# EAGLE design PowerSection (EAGLE 9.5.0)

## Sheet 1 of 2
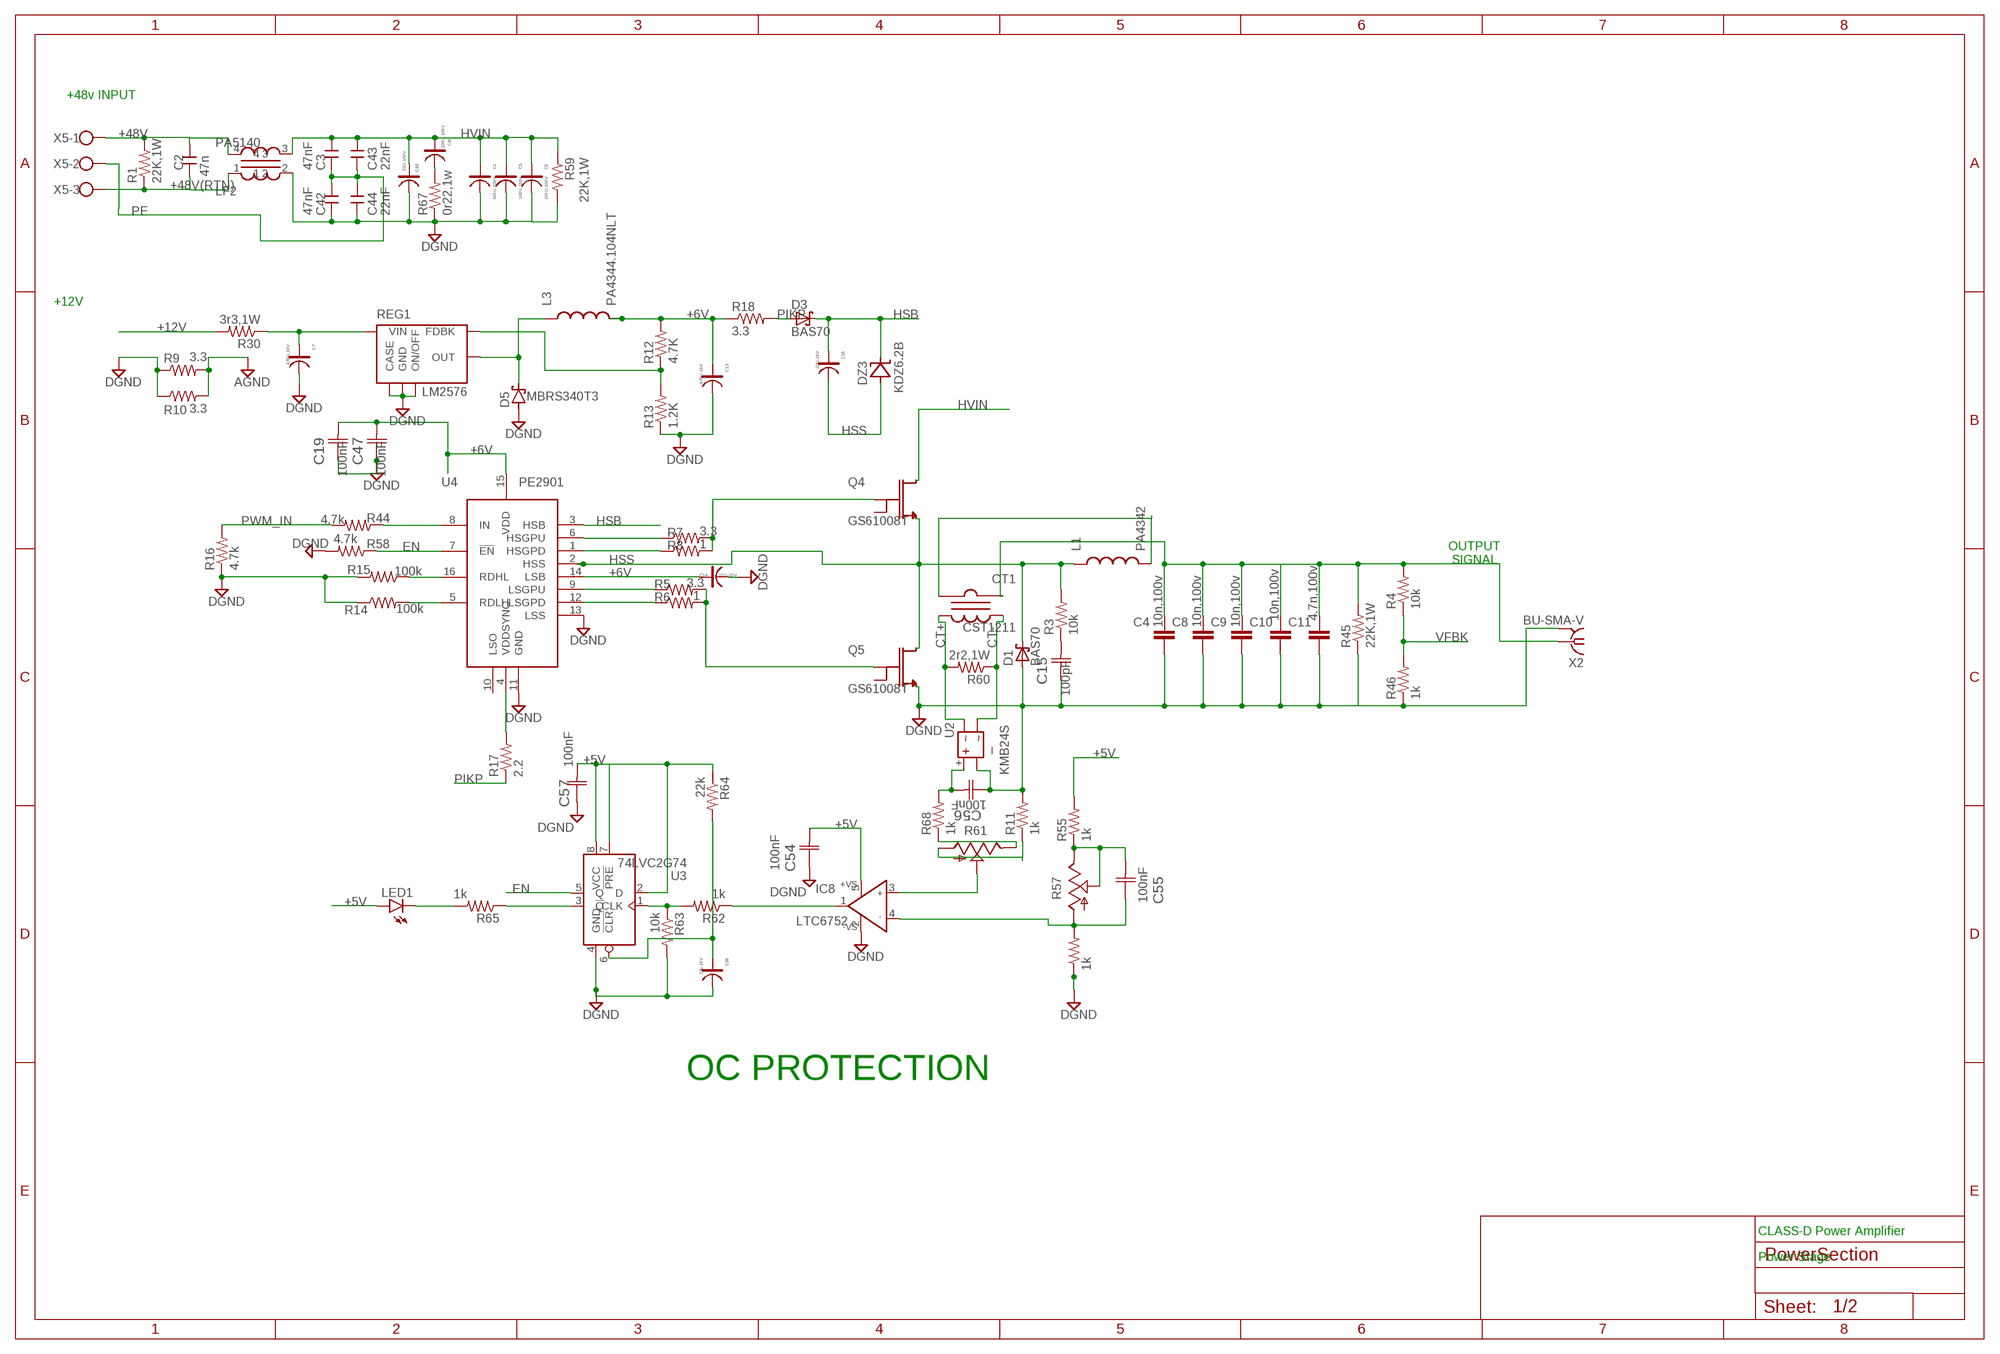
[diagram p0: schematic, sheet 1]

### Parts
C1  100U,100V  C-EDH-100V-100U  [CEL-EDH-9R]
C2  47n  C  [2220]
C3  47nF  C-SMD-2220  [2220]
C4  10n,100v  C-EUC2220K  [C2220K]
C5  100U,100v  C-EDH-100V-100U  [CEL-EDH-9R]
C6  100U,100V  C-EDH-100V-100U  [CEL-EDH-9R]
C7  470U,16V  C-EDH-470U,16V  [CEL-EDH-9P]
C8  10n,100v  C-EUC2220K  [C2220K]
C9  10n,100v  C-EUC2220K  [C2220K]
C10  10n,100v  C-EUC2220K  [C2220K]
C11  4.7n,100v  C-EUC2225K  [C2225K]
C13  470U,16V  C-EDH-470U,16V  [CEL-EDH-9P]
C14  10U-16V  C-EDK-10U-16V  [CEL-EDK-9B]
C15  100pF  C1206C104K1RACTU  [CAPC3216X88N]
C16  22U,16V  C-EDK-22U-16V  [CEL-EDK-9D]
C19  100nF  C1206C104K1RACTU  [CAPC3216X88N]
C42  47nF  C-SMD-2220  [2220]
C43  22nF  C-SMD-2220  [2220]
C44  22nF  C-SMD-2220  [2220]
C45  22U,100V  C-EDH-100V-22U  [CEL-EDH-9M]
C46  100U,100V  C-EDH-100V-100U  [CEL-EDH-9R]
C47  100nF  C1206C104K1RACTU  [CAPC3216X88N]
C54  100nF  C1206C104K5RACTU  [CAPC3216X88N]
C55  100nF  C1206C104K5RACTU  [CAPC3216X88N]
C56  100nF  C1206C104K5RACTU  [CAPC3216X88N]
C57  100nF  C1206C104K5RACTU  [CAPC3216X88N]
C58  22u,16V  C-EDK-22U-16V  [CEL-EDK-9D]
CT1  CST1211  [CST1211]
D1  BAS70  [SOT23]
D3  BAS70  [SOT23]
D5  MBRS340T3  [SMC]
DZ3  KDZ6.2B  KDZ36B  [SOD123FL]
IC8  LTC6752  AD8065RT  [SOT23-5]
L1  PA4342  [PA4342]
L3  PA4344.104NLT  [104NLT]
LED1  LEDCHIPLED_1206  [CHIPLED_1206]
LF2  PA5140  [PA5140.XXXNL]
Q4  GS61008T  [61008T]
Q5  GS61008T  [61008T]
R1  22K,1W  R-US_R2512W  [R2512W]
R3  10k  R-US_R1206  [R1206]
R4  10k  R-US_R1206  [R1206]
R5  3.3  R-US_R1206  [R1206]
R6  1  R-US_R1206  [R1206]
R7  3.3  R-US_R1206  [R1206]
R8  1  R-US_R1206  [R1206]
R9  3.3  R-US_R1206  [R1206]
R10  3.3  R-US_R1206  [R1206]
R11  1k  R-US_R1206  [R1206]
R12  4.7K  R-US_R1206  [R1206]
R13  1.2K  R-US_R1206  [R1206]
R14  100k  R-US_R1206  [R1206]
R15  100k  R-US_R1206  [R1206]
R16  4.7k  R-US_R1206  [R1206]
R17  2.2  R-US_R1206  [R1206]
R18  3.3  R-US_R1206  [R1206]
R30  3r3,1W  R-US_R2512W  [R2512W]
R44  4.7k  R-US_R1206  [R1206]
R45  22K,1W  R-US_R2512W  [R2512W]
R46  1k  R-US_R1206  [R1206]
R55  1k  R-US_R1206  [R1206]
R56  1k  R-US_R1206  [R1206]
R57  TRIM_US-3223G  [3223G]
R58  4.7k  R-US_R1206  [R1206]
R59  22K,1W  R-US_R2512W  [R2512W]
R60  2r2,1W  R-US_R2512W  [R2512W]
R61  TRIM_US-3223G  [3223G]
R62  1k  R-US_R1206  [R1206]
R63  10k  R-US_R1206  [R1206]
R64  22k  R-US_R1206  [R1206]
R65  1k  R-US_R1206  [R1206]
R67  0r22,1w  R-US_R2512W  [R2512W]
R68  1k  R-US_R1206  [R1206]
REG1  LM2576  [TO263-5]
U2  KMB24S  [SOIC-4]
U3  74LVC2G74  [SOT765]
U4  PE2901  [BGA20C40P5X4_164X204X28]
X2  BU-SMA-V  [BU-SMA-V]
X5  W237-103  [W237-103]

### Nets
+5V: C54.2(C2) C57.2(C2) IC8.5(+VS) LED1.A R55.2 R64.1 U3.2(D) U3.7(!PRE) U3.8(VCC) ; also sheet 2
+6V: C13.1 C14.1 C19.2(C2) C47.2(C2) L3.2 R12.2 R18.1 U4.14(LSB) U4.15(VDD)
+12V: R30.2 ; also sheet 2
+48V: C2.2 LF2.4 R1.2 X5.1 ; also sheet 2
+48V(RTN): C2.1 LF2.1 R1.1 X5.3 ; also sheet 2
AGND: R9.2 R10.2 ; also sheet 2
CT+: CT1.4(V_-) R60.2 U2.~2
CT-: CT1.5(V_+) R60.1 U2.~1
DGND: C1.2 C4.2 C5.2 C6.2 C7.2 C8.2 C9.2 C10.2 C11.2 C13.2 C14.2 C15.1(C1) C19.1(C1) C42.1 C44.1 C45.2 C47.1(C1) C54.1(C1) C56.1(C1) C57.1(C1) C58.2 D1.1(A) D5.A IC8.2(-VS) LF2.2 Q5.3 R9.1 R10.1 R11.2 R13.1 R14.1 R15.2 R16.1 R45.1 R46.1 R56.1 R58.2 R59.2 R63.2 R67.1 REG1.3(GND) REG1.5(ON/OFF) REG1.6(CASE) U2.- U3.4(GND) U4.11(GND) U4.13(LSS) X2.2 X2.3 X2.4 X2.5 ; also sheet 2
EN: R58.1 U3.5(Q) U4.7(!EN!)
HSB: C16.1 D3.3(K) DZ3.C U4.3(HSB)
HSS: C16.2 D1.3(K) DZ3.A L1.P$1 Q4.3 Q5.1 R3.2 U4.2(HSS)
HVIN: C1.1 C3.2 C5.1 C6.1 C43.2 C45.1 C46.1 LF2.3 Q4.1 R59.1
N$2: R61.3(E) R68.1
N$3: C4.1 C8.1 C9.1 C10.1 C11.1 CT1.1(C_IN) R4.2 R45.2 X2.1
N$4: C15.2(C2) R3.1
N$5: C7.1 R30.1 REG1.1(VIN)
N$6: R12.1 R13.2 REG1.4(FDBK)
N$7: D5.C L3.1 REG1.2(OUT)
N$8: R44.1 U4.8(IN)
N$9: R11.1 R61.1(A)
N$10: R15.1 U4.16(RDHL)
N$11: R17.2 U4.4(VDDSYNC)
N$12: R7.1 U4.6(HSGPU)
N$13: R8.1 U4.1(HSGPD)
N$14: R5.1 U4.9(LSGPU)
N$15: R6.1 U4.12(LSGPD)
N$20: CT1.2(C_OUT) L1.P$2
N$21: Q5.2 R5.2 R6.2
N$56: C56.2(C2) R68.2 U2.+
N$58: C46.2 R67.2
N$59: R14.2 U4.5(RDLH)
N$61: Q4.2 R7.2 R8.2
N$68: C55.1(C1) IC8.4(IN-) R56.2 R57.1(A)
N$69: IC8.3(IN+) R61.2(S)
N$70: IC8.1(OUT) R62.1
N$71: C55.2(C2) R55.1 R57.2(S) R57.3(E)
N$72: R62.2 R63.1 U3.1(CLK)
N$74: LED1.C R65.2
N$75: C58.1 R64.2 U3.6(!CLR)
N$76: R65.1 U3.3(!Q)
PE: C3.1 C42.2 C43.1 C44.2 X5.2 ; also sheet 2
PIKP: D3.1(A) R17.1 R18.2
PWM_IN: R16.2 R44.2 ; also sheet 2
VFBK: R4.1 R46.2 ; also sheet 2
Unconnected: Q4.4 Q5.4 U4.10(LSO)

### Notes on the sheet
- +48v INPUT
- +12V
- OUTPUT
   SIGNAL
- OC PROTECTION
- CLASS-D Power Amplifier
- Power Stage

## Sheet 2 of 2
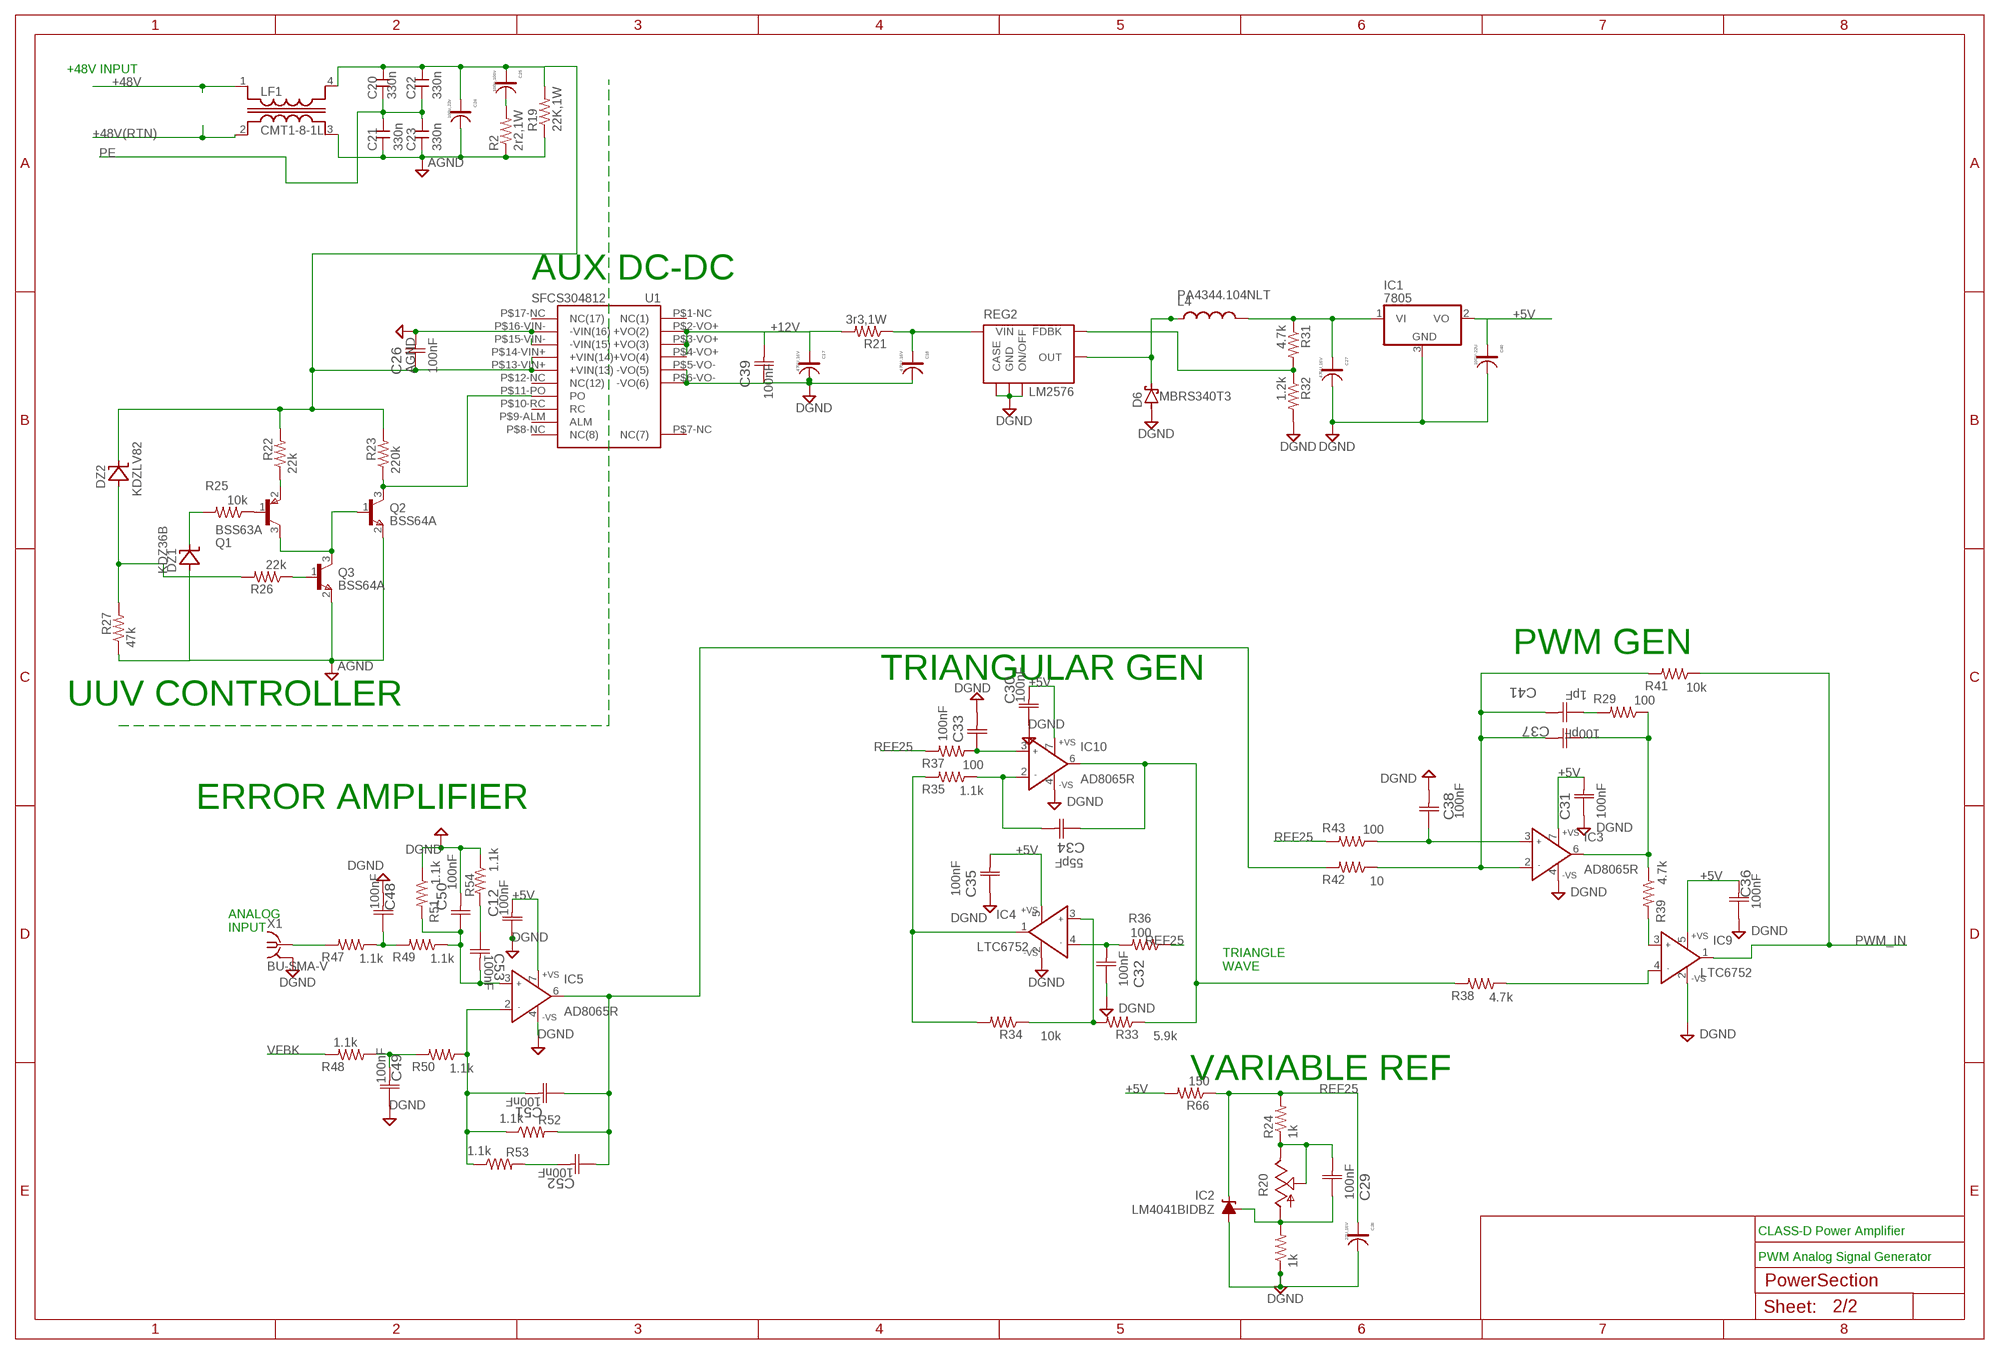
[diagram p1: schematic, sheet 2]

### Parts
C12  100nF  C1206C104K5RACTU  [CAPC3216X88N]
C17  470U,16V  C-EDH-470U,16V  [CEL-EDH-9P]
C18  470U,16V  C-EDH-470U,16V  [CEL-EDH-9P]
C20  330n  C  [2220]
C21  330n  C  [2220]
C22  330n  C  [2220]
C23  330n  C  [2220]
C24  100u,22v  C-EDH-100V-22U  [CEL-EDH-9M]
C25  100u,100v  C-EDH-100V-100U  [CEL-EDH-9R]
C26  100nF  C1206C104K1RACTU  [CAPC3216X88N]
C27  470U,16V  C-EDH-470U,16V  [CEL-EDH-9P]
C28  22U,16V  C-EDK-22U-16V  [CEL-EDK-9D]
C29  100nF  C1206C104K5RACTU  [CAPC3216X88N]
C30  100nF  C1206C104K5RACTU  [CAPC3216X88N]
C31  100nF  C1206C104K5RACTU  [CAPC3216X88N]
C32  100nF  C1206C104K5RACTU  [CAPC3216X88N]
C33  100nF  C1206C104K5RACTU  [CAPC3216X88N]
C34  55pF  C1206C104K5RACTU  [CAPC3216X88N]
C35  100nF  C1206C104K5RACTU  [CAPC3216X88N]
C36  100nF  C1206C104K5RACTU  [CAPC3216X88N]
C37  100pF  C1206C104K5RACTU  [CAPC3216X88N]
C38  100nF  C1206C104K5RACTU  [CAPC3216X88N]
C39  100nF  C1206C104K1RACTU  [CAPC3216X88N]
C40  100V-22U  C-EDH-100V-22U  [CEL-EDH-9M]
C41  1pF  C1206C104K5RACTU  [CAPC3216X88N]
C48  100nF  C1206C104K5RACTU  [CAPC3216X88N]
C49  100nF  C1206C104K5RACTU  [CAPC3216X88N]
C50  100nF  C1206C104K5RACTU  [CAPC3216X88N]
C51  100nF  C1206C104K5RACTU  [CAPC3216X88N]
C52  100nF  C1206C104K5RACTU  [CAPC3216X88N]
C53  100nF  C1206C104K5RACTU  [CAPC3216X88N]
D6  MBRS340T3  [SMC]
DZ1  KDZ36B  [SOD123FL]
DZ2  KDZLV82  [SOD123FL]
IC1  7805  7815DT  [TO252]
IC2  LM4041BIDBZ  [DBZ_R-PDSO-G3]
IC3  AD8065R  [SO8]
IC4  LTC6752  AD8065RT  [SOT23-5]
IC5  AD8065R  [SO8]
IC9  LTC6752  AD8065RT  [SOT23-5]
IC10  AD8065R  [SO8]
L4  PA4344.104NLT  [104NLT]
LF1  CMT1-8-1L  [CMT1-8-1L]
Q1  BSS63A  [SOT23]
Q2  BSS64A  [SOT23]
Q3  BSS64A  [SOT23]
R2  2r2,1W  R-US_R2512W  [R2512W]
R19  22K,1W  R-US_R2512W  [R2512W]
R20  TRIM_US-3223G  [3223G]
R21  3r3,1W  R-US_R2512W  [R2512W]
R22  22k  R-US_R1206  [R1206]
R23  220k  R-US_R1206  [R1206]
R24  1k  R-US_R1206  [R1206]
R25  10k  R-US_R1206  [R1206]
R26  22k  R-US_R1206  [R1206]
R27  47k  R-US_R1206  [R1206]
R28  1k  R-US_R1206  [R1206]
R29  100  R-US_R1206  [R1206]
R31  4.7k  R-US_R1206  [R1206]
R32  1.2k  R-US_R1206  [R1206]
R33  5.9k  R-US_R1206  [R1206]
R34  10k  R-US_R1206  [R1206]
R35  1.1k  R-US_R1206  [R1206]
R36  100  R-US_R1206  [R1206]
R37  100  R-US_R1206  [R1206]
R38  4.7k  R-US_R1206  [R1206]
R39  4.7k  R-US_R1206  [R1206]
R41  10k  R-US_R1206  [R1206]
R42  10  R-US_R1206  [R1206]
R43  100  R-US_R1206  [R1206]
R47  1.1k  R-US_R1206  [R1206]
R48  1.1k  R-US_R1206  [R1206]
R49  1.1k  R-US_R1206  [R1206]
R50  1.1k  R-US_R1206  [R1206]
R51  1.1k  R-US_R1206  [R1206]
R52  1.1k  R-US_R1206  [R1206]
R53  1.1k  R-US_R1206  [R1206]
R54  1.1k  R-US_R1206  [R1206]
R66  150  R-US_R1206  [R1206]
REG2  LM2576  [TO263-5]
U1  SFCS304812  [SFCS_SMD]
X1  BU-SMA-V  [BU-SMA-V]

### Nets
+5V: C12.2(C2) C30.2(C2) C31.2(C2) C35.2(C2) C36.2(C2) C40.1 IC1.2(VO) IC3.7(+VS) IC4.5(+VS) IC5.7(+VS) IC9.5(+VS) IC10.7(+VS) R66.2 ; also sheet 1
+12V: C17.1 C39.2(C2) R21.2 U1.P$2-VO+(+VO(2)) U1.P$3-VO+(+VO(3)) U1.P$4-VO+(+VO(4)) ; also sheet 1
+48V: LF1.1 ; also sheet 1
+48V(RTN): LF1.2 ; also sheet 1
AGND: C21.1 C23.1 C24.2 C26.2(C2) DZ1.A LF1.3 Q2.2(E) Q3.2(E) R2.1 R19.1 R27.1 U1.P$16-VIN-(-VIN(16)) ; also sheet 1
DGND: C12.1(C1) C17.2 C18.2 C27.2 C28.2 C30.1(C1) C31.1(C1) C32.1(C1) C33.2(C2) C35.1(C1) C36.1(C1) C38.2(C2) C39.1(C1) C40.2 C48.2(C2) C49.1(C1) C50.2(C2) D6.A IC1.3(GND) IC2.3(A) IC3.4(-VS) IC4.2(-VS) IC5.4(-VS) IC9.2(-VS) IC10.4(-VS) R28.1 R32.2 R51.1 R54.1 REG2.3(GND) REG2.5(ON/OFF) REG2.6(CASE) U1.P$5-VO-(-VO(5)) U1.P$6-VO-(-VO(6)) X1.2 X1.3 X1.4 X1.5 ; also sheet 1
N$1: C25.2 R2.2
N$16: R47.2 X1.1
N$17: C48.1(C1) R47.1 R49.2
N$18: C50.1(C1) C53.2(C2) IC5.3(IN+) R49.1 R51.2
N$22: C20.2 C22.2 C24.1 C25.1 C26.1(C1) DZ2.C LF1.4 R19.2 R22.2 R23.2 U1.P$13-VIN+(+VIN(13))
N$23: Q1.1(B) R25.1
N$24: C18.1 R21.1 REG2.1(VIN)
N$28: Q1.2(E) R22.1
N$29: Q2.3(C) R23.1 U1.P$11-PO(PO)
N$30: DZ1.C R25.2
N$31: DZ2.A R26.2 R27.2
N$32: U1.P$14-VIN+(+VIN(14))
N$34: Q3.1(B) R26.1
N$35: U1.P$15-VIN-(-VIN(15))
N$37: R31.2 R32.1 REG2.4(FDBK)
N$38: D6.C L4.1 REG2.2(OUT)
N$39: C32.2(C2) IC4.4(IN-) R36.2
N$40: C33.1(C1) IC10.3(IN+) R37.1
N$41: C34.2(C2) IC10.2(IN-) R35.1
N$42: C34.1(C1) IC10.6(OUT) R33.1 R38.2
N$43: IC9.4(IN-) R38.1
N$44: C51.1(C1) C52.1(C1) IC5.6(OUT) R42.2 R52.2
N$45: C37.2(C2) C41.2(C2) IC3.2(IN-) R41.2 R42.1
N$46: IC4.3(IN+) R33.2 R34.1
N$47: IC4.1(OUT) R34.2 R35.2
N$48: Q1.3(C) Q2.1(B) Q3.3(C)
N$49: C29.2(C2) R20.2(S) R20.3(E) R24.1
N$50: C38.1(C1) IC3.3(IN+) R43.1
N$51: IC9.3(IN+) R39.2
N$52: C37.1(C1) IC3.6(OUT) R29.1 R39.1
N$53: C27.1 IC1.1(VI) L4.2 R31.1
N$54: C29.1(C1) IC2.1(FB) R20.1(A) R28.2
N$55: C41.1(C1) R29.2
N$62: C51.2(C2) IC5.2(IN-) R50.1 R52.1 R53.1
N$64: C49.2(C2) R48.1 R50.2
N$65: C53.1(C1) R54.2
N$67: C52.2(C2) R53.2
PE: C20.1 C21.2 C22.1 C23.2 ; also sheet 1
PWM_IN: IC9.1(OUT) R41.1 ; also sheet 1
REF25: C28.1 IC2.2(C) R24.2 R36.1 R37.2 R43.2 R66.1
VFBK: R48.2 ; also sheet 1
Unconnected: U1.P$1-NC(NC(1)) U1.P$7-NC(NC(7)) U1.P$8-NC(NC(8)) U1.P$9-ALM(ALM) U1.P$10-RC(RC) U1.P$12-NC(NC(12)) U1.P$17-NC(NC(17))

### Notes on the sheet
- +48V INPUT
- AUX DC-DC
- PWM GEN
- TRIANGULAR GEN
- UUV CONTROLLER
- ERROR AMPLIFIER
- ANALOG
  INPUT
- TRIANGLE
  WAVE
- VARIABLE REF
- CLASS-D Power Amplifier
- PWM Analog Signal Generator

## Library data of the parts
C1 C5 C6 C25 C46 = thesislib:C-EDH-100V-100U
C2 C20-C23 = thesislib:C: CAPACITOR
C3 C42-C44 = thesislib:C-SMD-2220: CAPACITOR
C4 C8-C11 = rcl:C-EU: CAPACITOR, European symbol; SPICEPREFIX: C
C7 C13 C17 C18 C27 = thesislib:C-EDH-470U,16V
C12 C29-C33 C35 C36 C38 C48-C57 = Kemet_By_element14_Batch_1:C1206C104K5RACTU: CAPACITOR, 1206; MPN: C1206C104K5RACTU; OC_FARNELL: 1414715; OC_NEWARK: 70K9167; SUPPLIER: Kemet; TOLERANCE: ±10%; VOLTAGERATING: 50V
C14 = thesislib:C-EDK-10U-16V
C15 = Kemet_By_element14_Batch_1:C1206C104K1RACTU: CAPACITOR, 1206; MPN: C1206C104K1RACTU; OC_FARNELL: 1414714; OC_NEWARK: 85C2205; SUPPLIER: Kemet; TOLERANCE: ±10%; VALUE: 100nF; VOLTAGERATING: 100V
C16 C28 C58 = thesislib:C-EDK-22U-16V
C19 C26 C39 C47 = Kemet_By_element14_Batch_1:C1206C104K1RACTU: CAPACITOR, 1206; MPN: C1206C104K1RACTU; OC_FARNELL: 1414714; OC_NEWARK: 85C2205; SUPPLIER: Kemet; TOLERANCE: ±10%; VOLTAGERATING: 100V
C24 C40 C45 = thesislib:C-EDH-100V-22U
C34 C37 C41 = Kemet_By_element14_Batch_1:C1206C104K5RACTU: CAPACITOR, 1206; MPN: C1206C104K5RACTU; OC_FARNELL: 1414715; OC_NEWARK: 70K9167; SUPPLIER: Kemet; TOLERANCE: ±10%; VALUE: 100nF; VOLTAGERATING: 50V
CT1 = thesislib:CST1211
D1 D3 = nxp_60_1_1:BAS70: General-purpose Schottky diode General-purpose Schottky diodes in small Surface-Mounted Device (SMD) plastic packages. AAL Eindhoven MK
D5 D6 = diode:MBRS3*0T3: SCHOTTKY BARRIER RECTIFIER 3.0 AMPERES 20, 30, 40 VOLT Source: MBRS340T3-D.pdf
DZ1 DZ3 = thesislib:KDZ36B
DZ2 = thesislib:KDZLV82
IC1 = linear:78*: Positive VOLTAGE REGULATOR Source: http://cache.national.com/ds/LM/LM78L05.pdf http://www.fairchildsemi.com/ds/LM/LM7805.pdf
IC2 = texas:LM4041*I: PRECISION MICROPOWER SHUNT VOLTAGE REFERENCE Adjustable Output Source: http://focus.ti.com/lit/ds/slcs146e/slcs146e.pdf; OC_FARNELL: unknown; OC_NEWARK: unknown
IC3 IC5 IC10 = analog-devices:AD8065: High Performance, 145 MHz FastFET Op Amps Source: http://www.analog.com/static/imported-files/data_sheets/AD8065_8066.pdf; OC_FARNELL: unknown; OC_NEWARK: unknown
IC4 IC8 IC9 = analog-devices:AD8065: High Performance, 145 MHz FastFET Op Amps Source: http://www.analog.com/static/imported-files/data_sheets/AD8065_8066.pdf; MF: ALTERA CORPORATION; MPN: AD8065ARTZ-REEL7; OC_FARNELL: 1464845; OC_NEWARK: 59K6316
L1 = thesislib:PA4342
L3 L4 = thesislib:PA4344.104NLT
LED1 = led:LED: LED OSRAM: - CHIPLED LG R971, LG N971, LY N971, LG Q971, LY Q971, LO R971, LY R971 LH N974, LH R974 LS Q976, LO Q976, LY Q976 LO Q996 - Hyper CHIPLED LW Q18S LB Q993, LB Q99A, LB R99A - SideLED LS A670, LO A670, LY A670, LG A670, LP A670 LB A673, LV A673, LT A673, LW A673 LH A674 LY A675 LS A676, LA A676, LO A676, LY A676, LW A676 LS A679, LY A679, LG A679 - Hyper Micro SIDELED® LS Y876, LA Y876, LO Y876, LY Y876 LT Y87S - SmartLED LW L88C, LW L88S LB L89C, LB L89S, LG L890 LS L89K, LO L89K, LY L89K LS L896, LA L896, LO L896, LY L896 - TOPLED LS T670, LO T670, LY T670, LG T670, LP T670 LSG T670, LSP T670, LSY T670, LOP T670, LYG T670 LG T671, LOG T671, LSG T671 LB T673, LV T673, LT T673, LW T673 LH T674 LS T676, LA T676, LO T676, LY T676, LB T676, LH T676, LSB T676, LW T676 LB T67C, LV T67C, LT T67C, LS T67K, LO T67K, LY T67K, LW E67C LS E67B, LA E67B, LO E67B, LY E67B, LB E67C, LV E67C, LT E67C LW T67C LS T679, LY T679, LG T679 LS T770, LO T770, LY T770, LG T770, LP T770 LB T773, LV T773, LT T773, LW T773 LH T774 LS E675, LA E675, LY E675, LS T675 LS T776, LA T776, LO T776, LY T776, LB T776 LHGB T686 LT T68C, LB T68C - Hyper Mini TOPLED® LB M676 - Mini TOPLED Santana® LG M470 LS M47K, LO M47K, LY M47K Source: http://www.osram.convergy.de LUXEON: - LUMILED® LXK2-PW12-R00, LXK2-PW12-S00, LXK2-PW14-U00, LXK2-PW14-V00 LXK2-PM12-R00, LXK2-PM12-S00, LXK2-PM14-U00 LXK2-PE12-Q00, LXK2-PE12-R00, LXK2-PE12-S00, LXK2-PE14-T00, LXK2-PE14-U00 LXK2-PB12-K00, LXK2-PB12-L00, LXK2-PB12-M00, LXK2-PB14-N00, LXK2-PB14-P00, LXK2-PB14-Q00 LXK2-PR12-L00, LXK2-PR12-M00, LXK2-PR14-Q00, LXK2-PR14-R00 LXK2-PD12-Q00, LXK2-PD12-R00, LXK2-PD12-S00 LXK2-PH12-R00, LXK2-PH12-S00 LXK2-PL12-P00, LXK2-PL12-Q00, LXK2-PL12-R00 Source: www.luxeon.com KINGBRIGHT: KA-3528ASYC Source: www.kingbright.com
LF1 = thesislib:CMT1-8-1L
LF2 = thesislib:PA5140
Q1 = thesislib:BSS63A
Q2 Q3 = thesislib:BSS64A
Q4 Q5 = thesislib:GS61008T
R1-R19 R21-R39 R41-R56 R58-R60 R62-R68 = rcl:R-US_: RESISTOR, American symbol; SPICEPREFIX: R
R20 R57 R61 = pot:TRIM_US-: POTENTIOMETER
REG1 REG2 = thesislib:LM2576
U1 = thesislib:SFCS304812
U2 = thesislib:KMB24S
U3 = thesislib:74LVC2G74
U4 = thesislib:PE2901
X1 X2 = con-coax:BU-SMA-V: FEMALE SMA CONNECTOR Radiall distributor RS 112-3794; OC_FARNELL: unknown; OC_NEWARK: unknown
X5 = con-wago-500:W237-103: WAGO SCREW CLAMP; MPN: 237-103; OC_FARNELL: unknown; OC_NEWARK: 18M7116

## Board
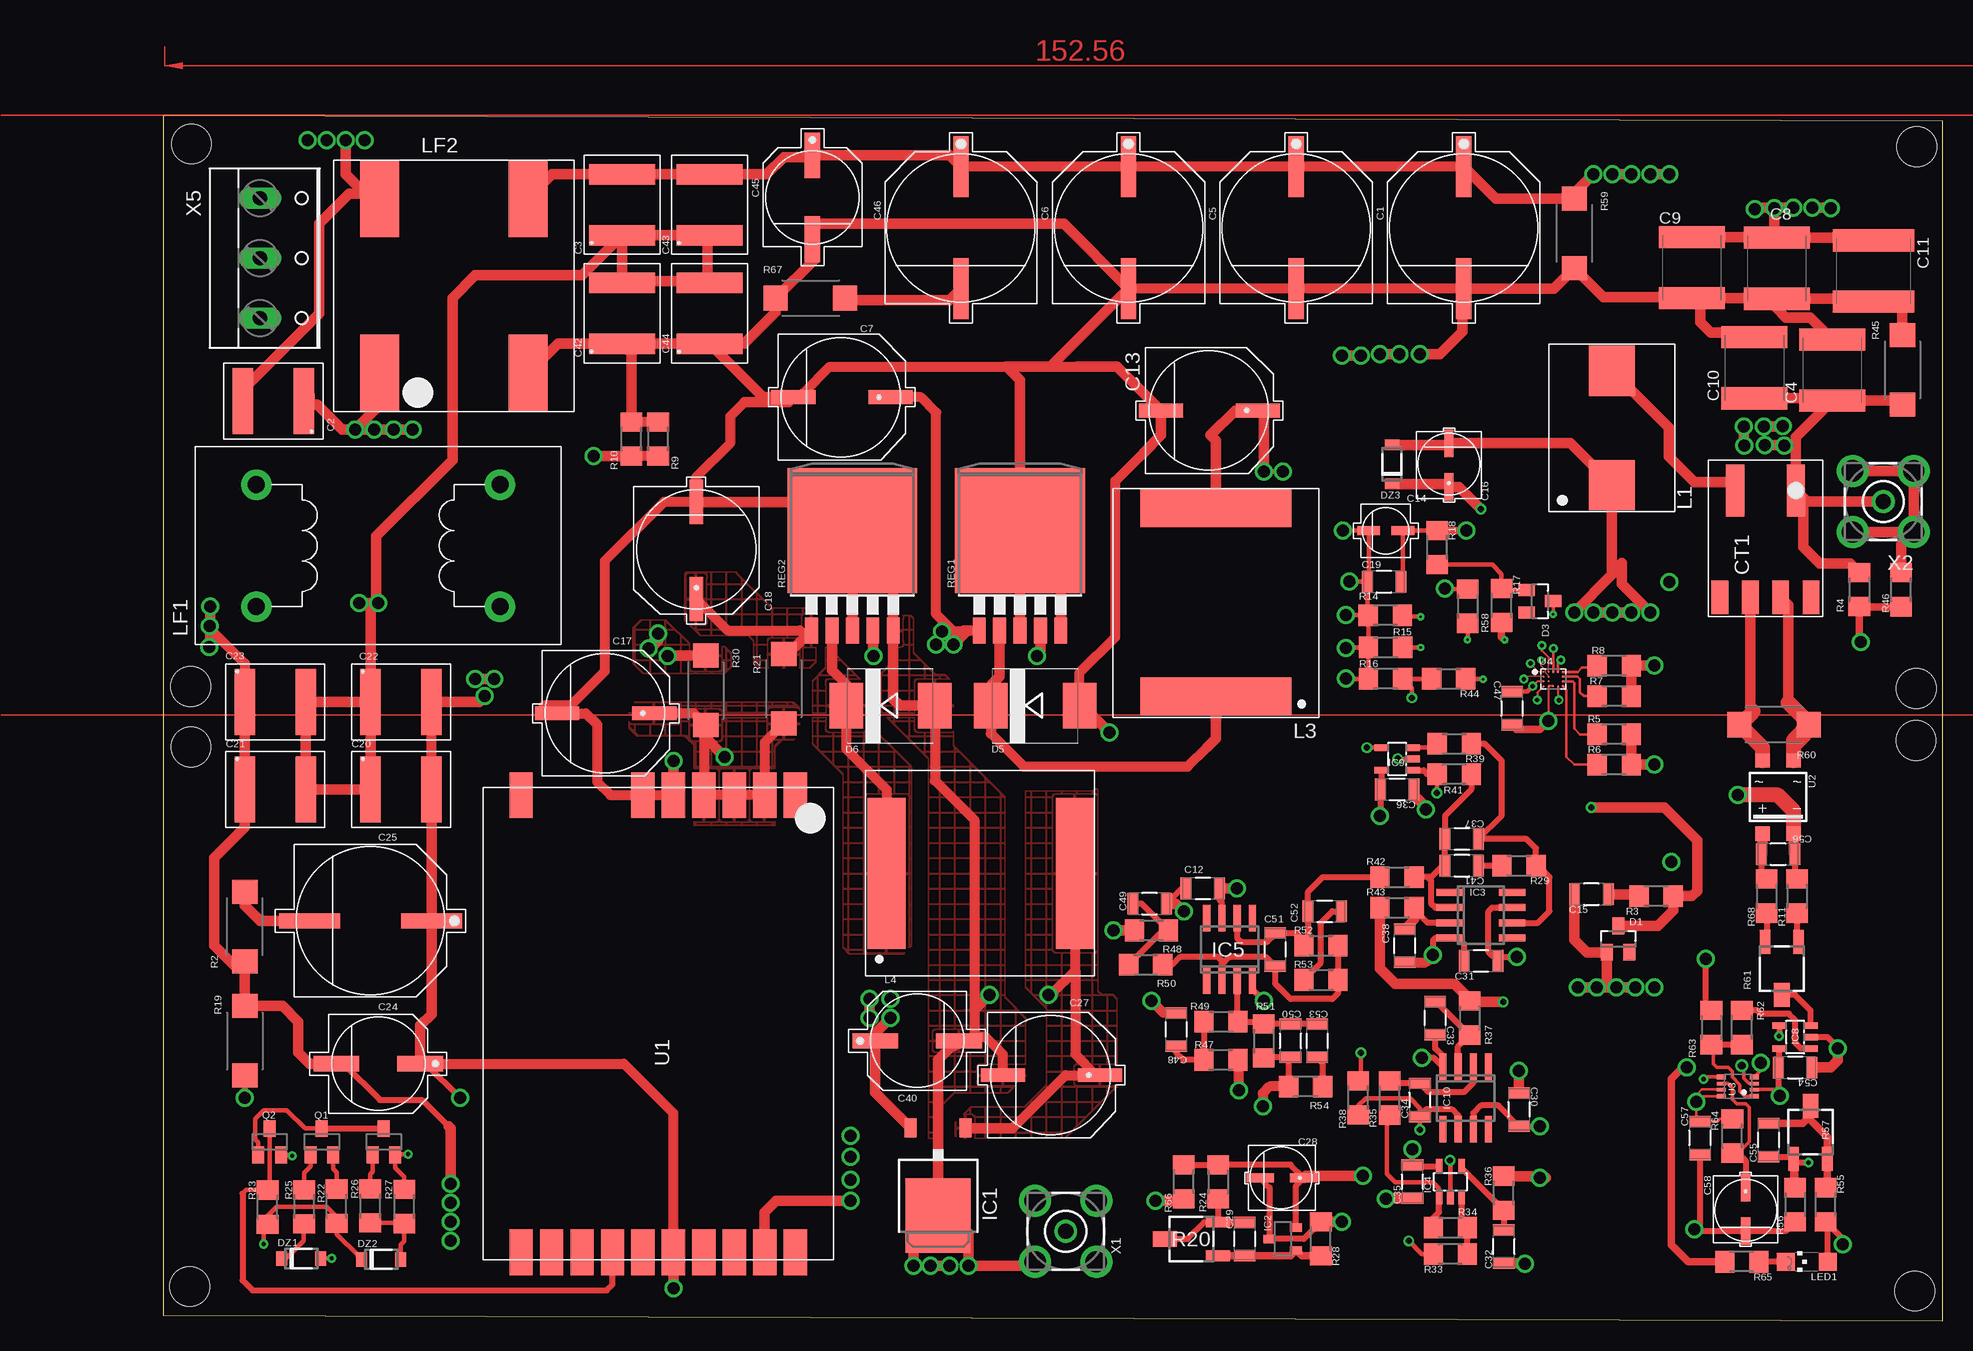
[diagram p2: board, top side]
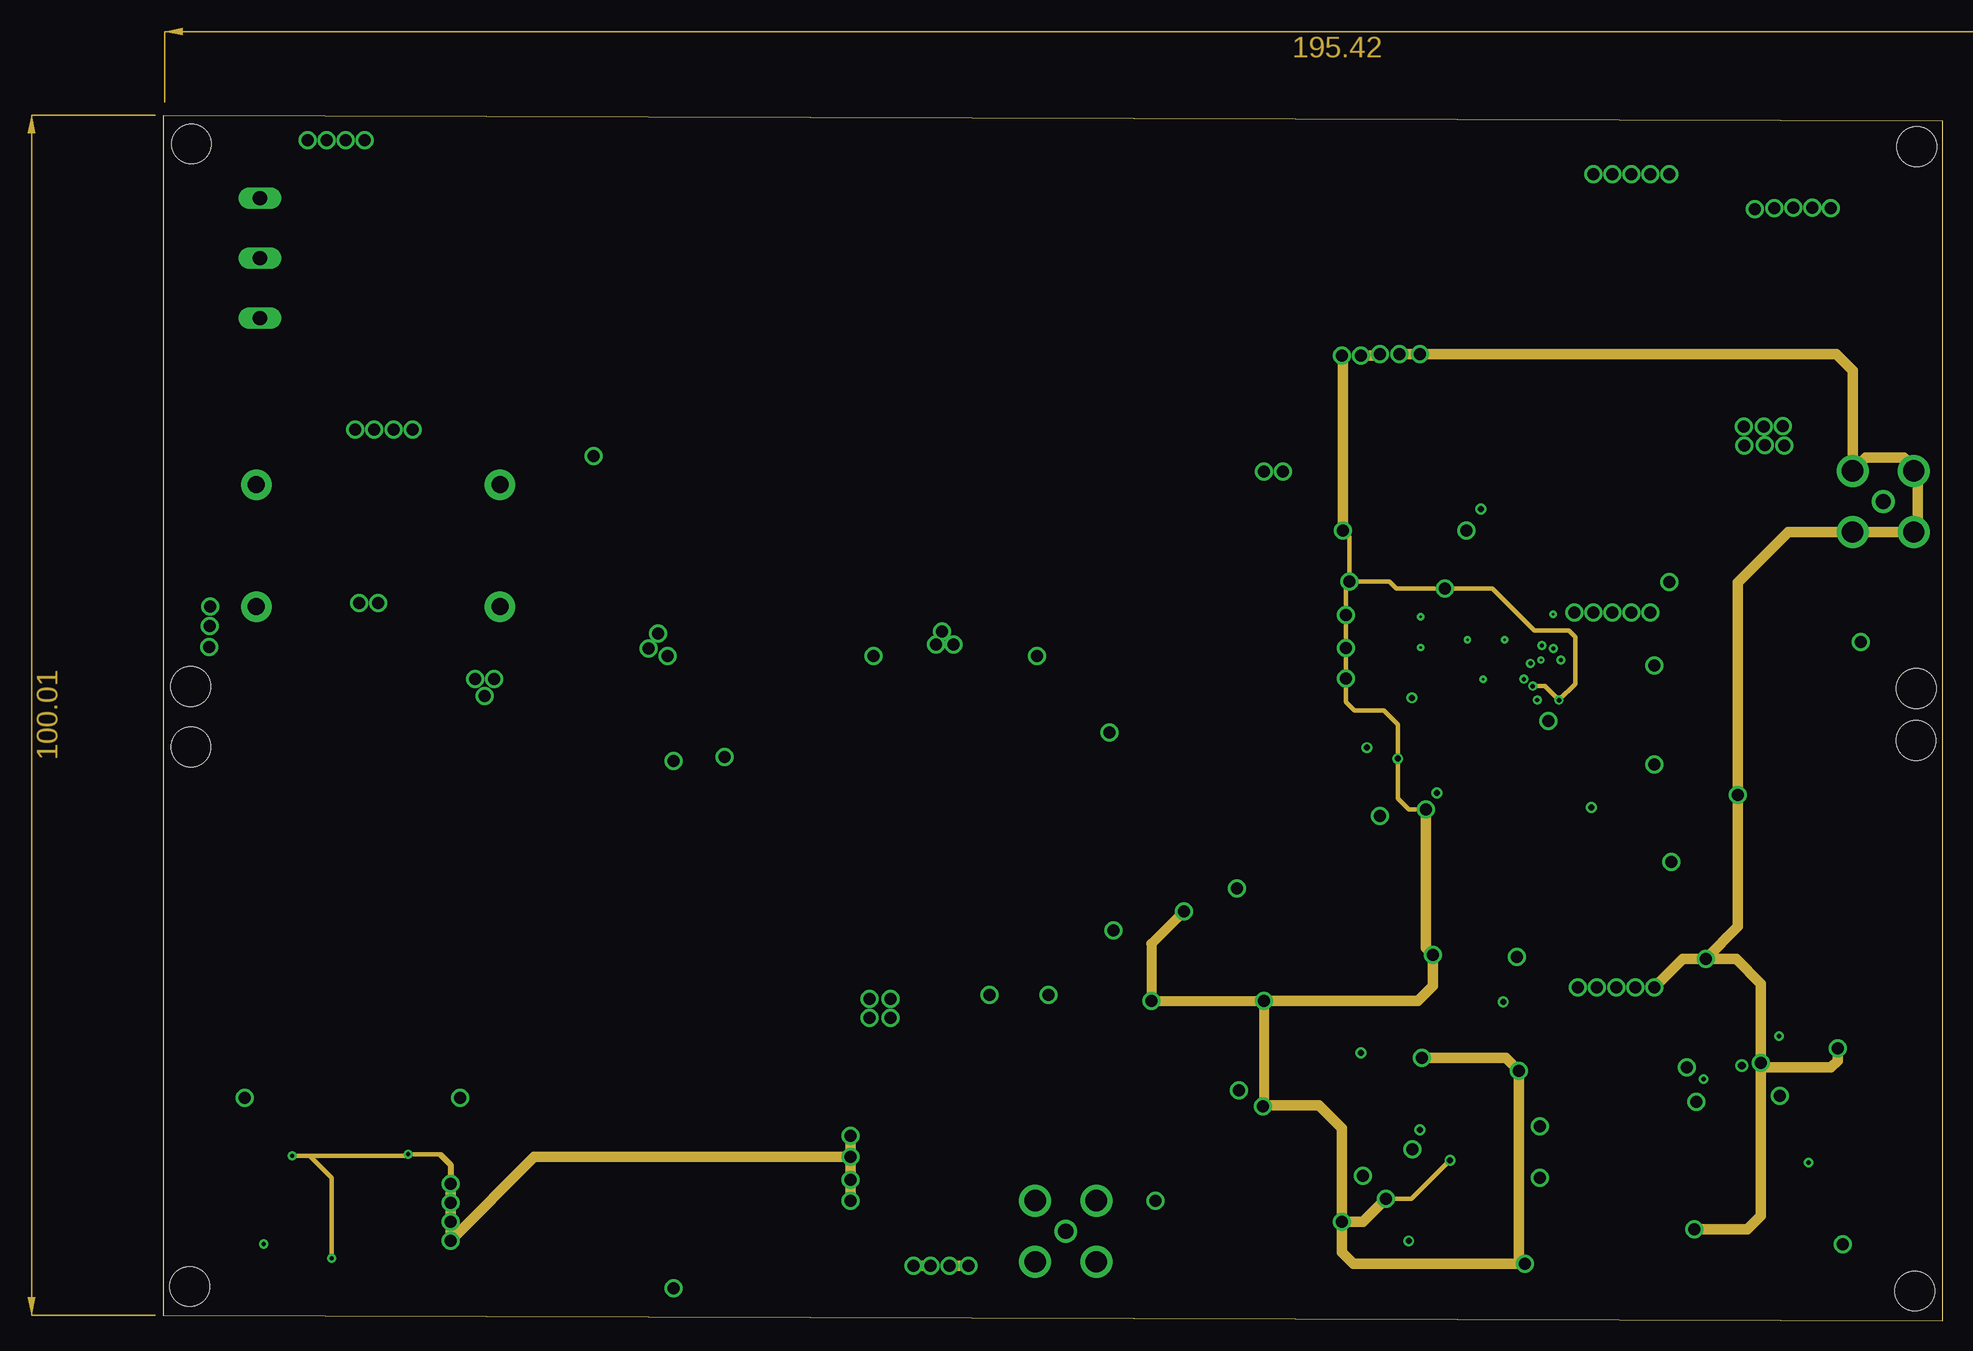
[diagram p3: board, inner layer Route2]
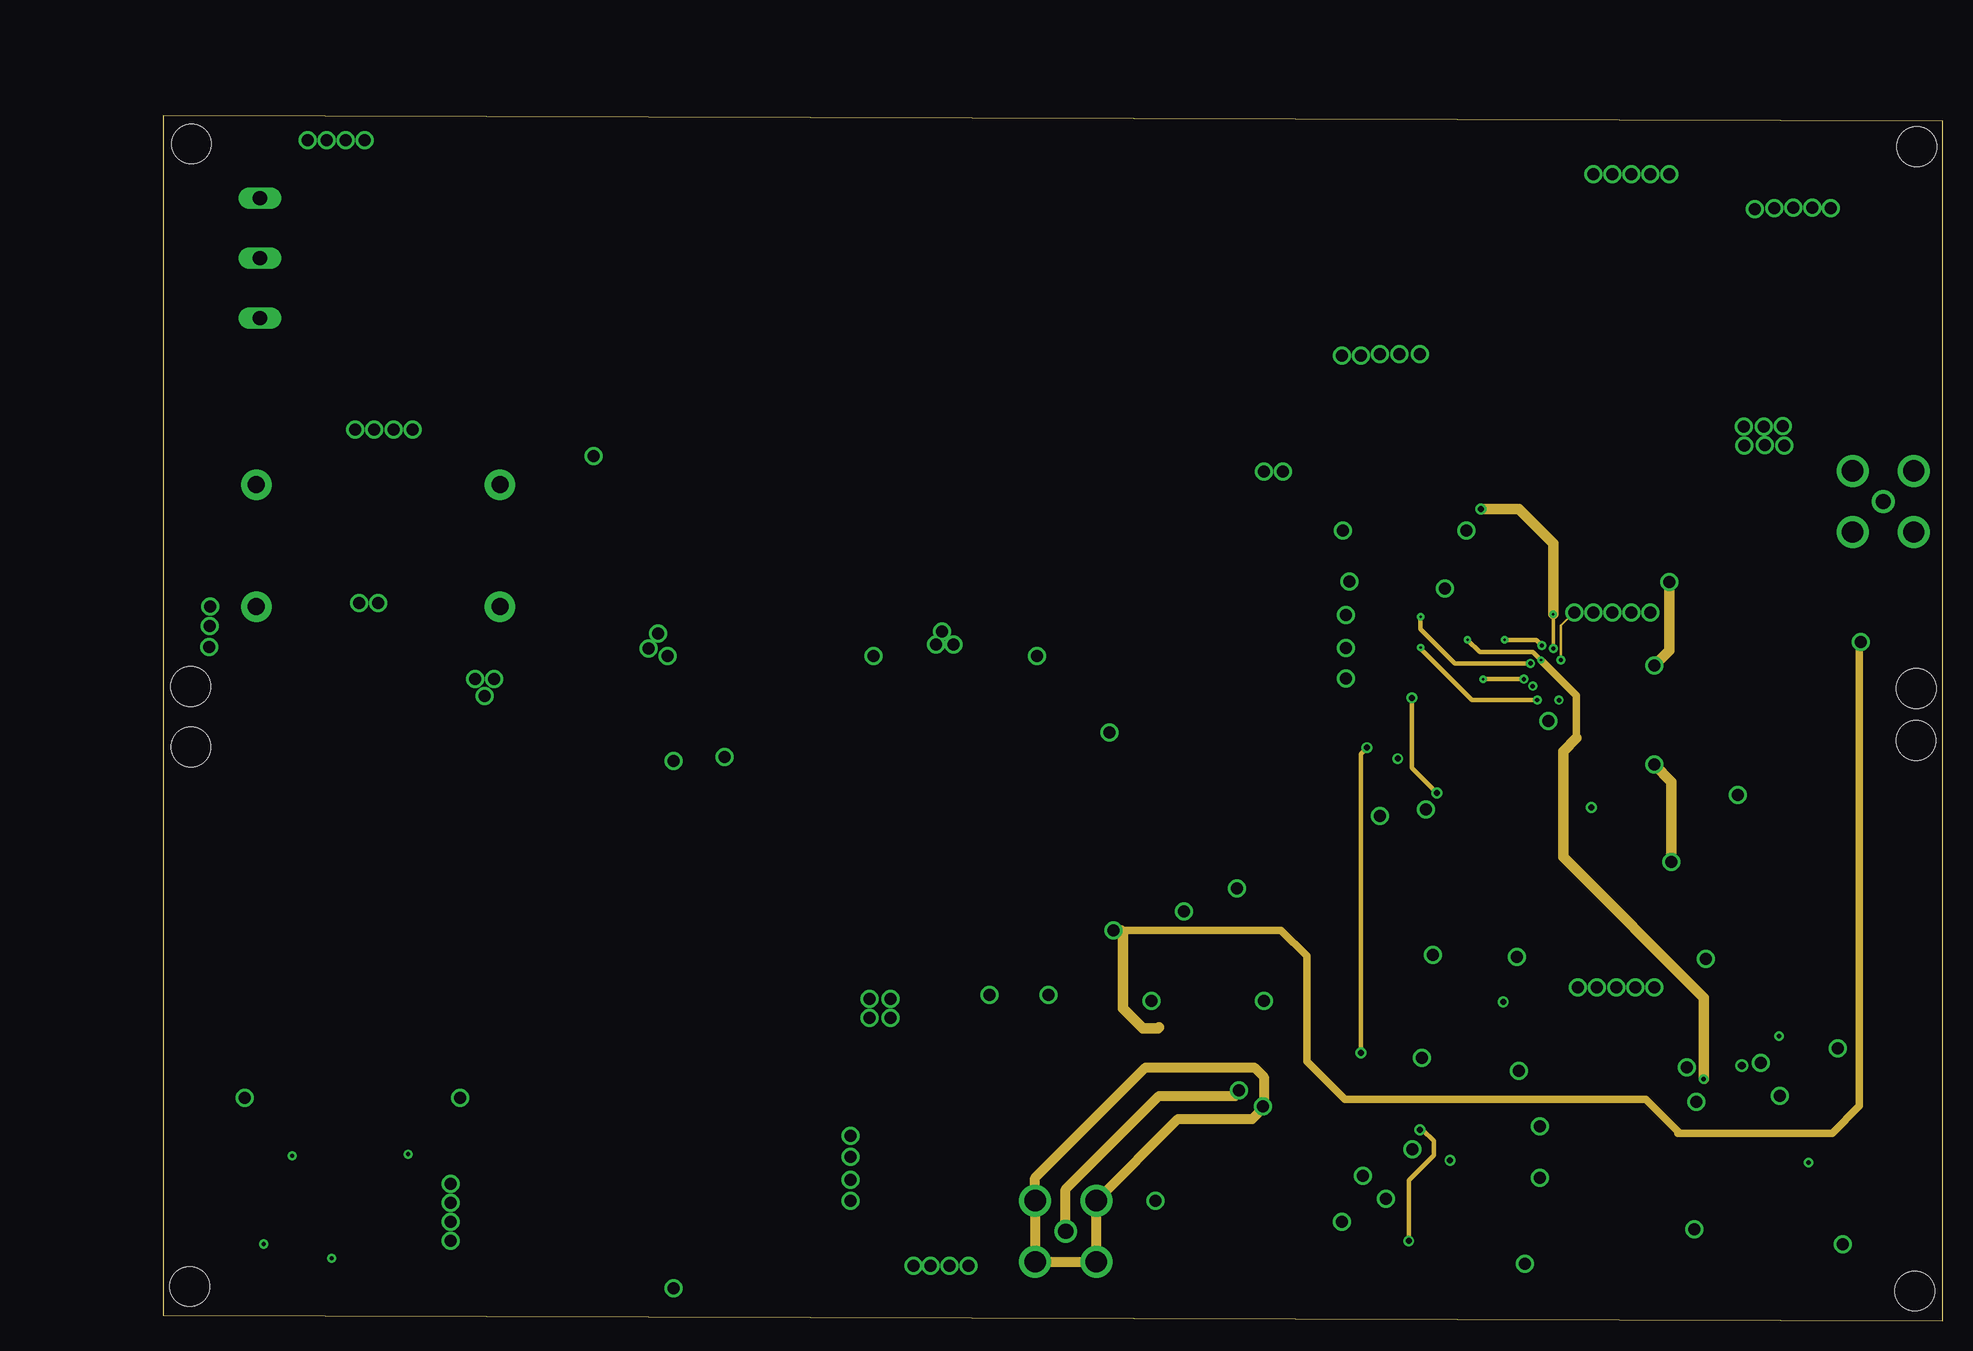
[diagram p4: board, inner layer Route3]
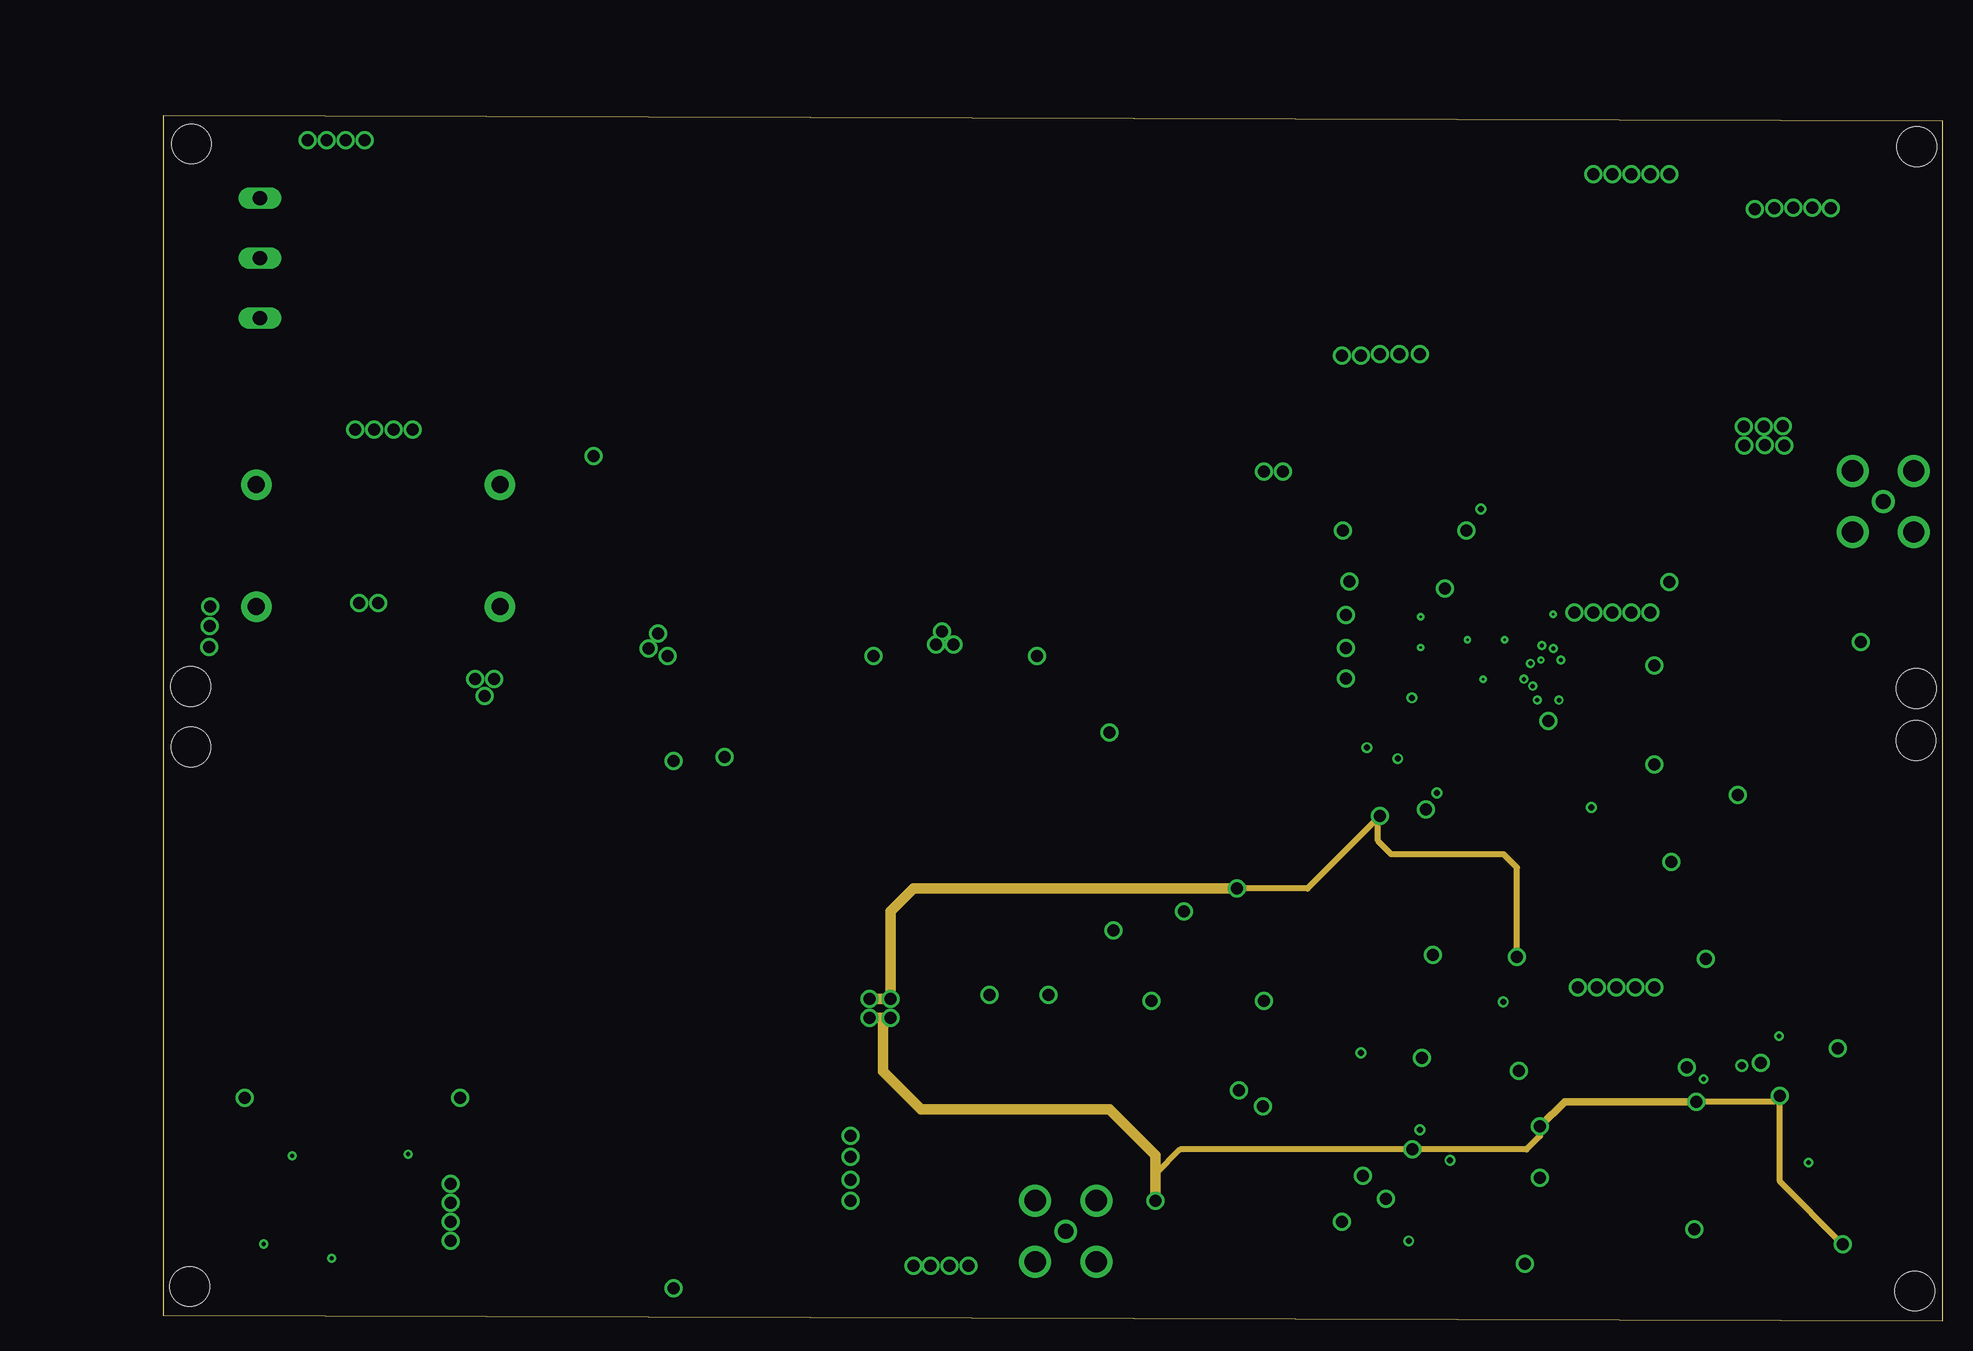
[diagram p5: board, inner layer Route14]
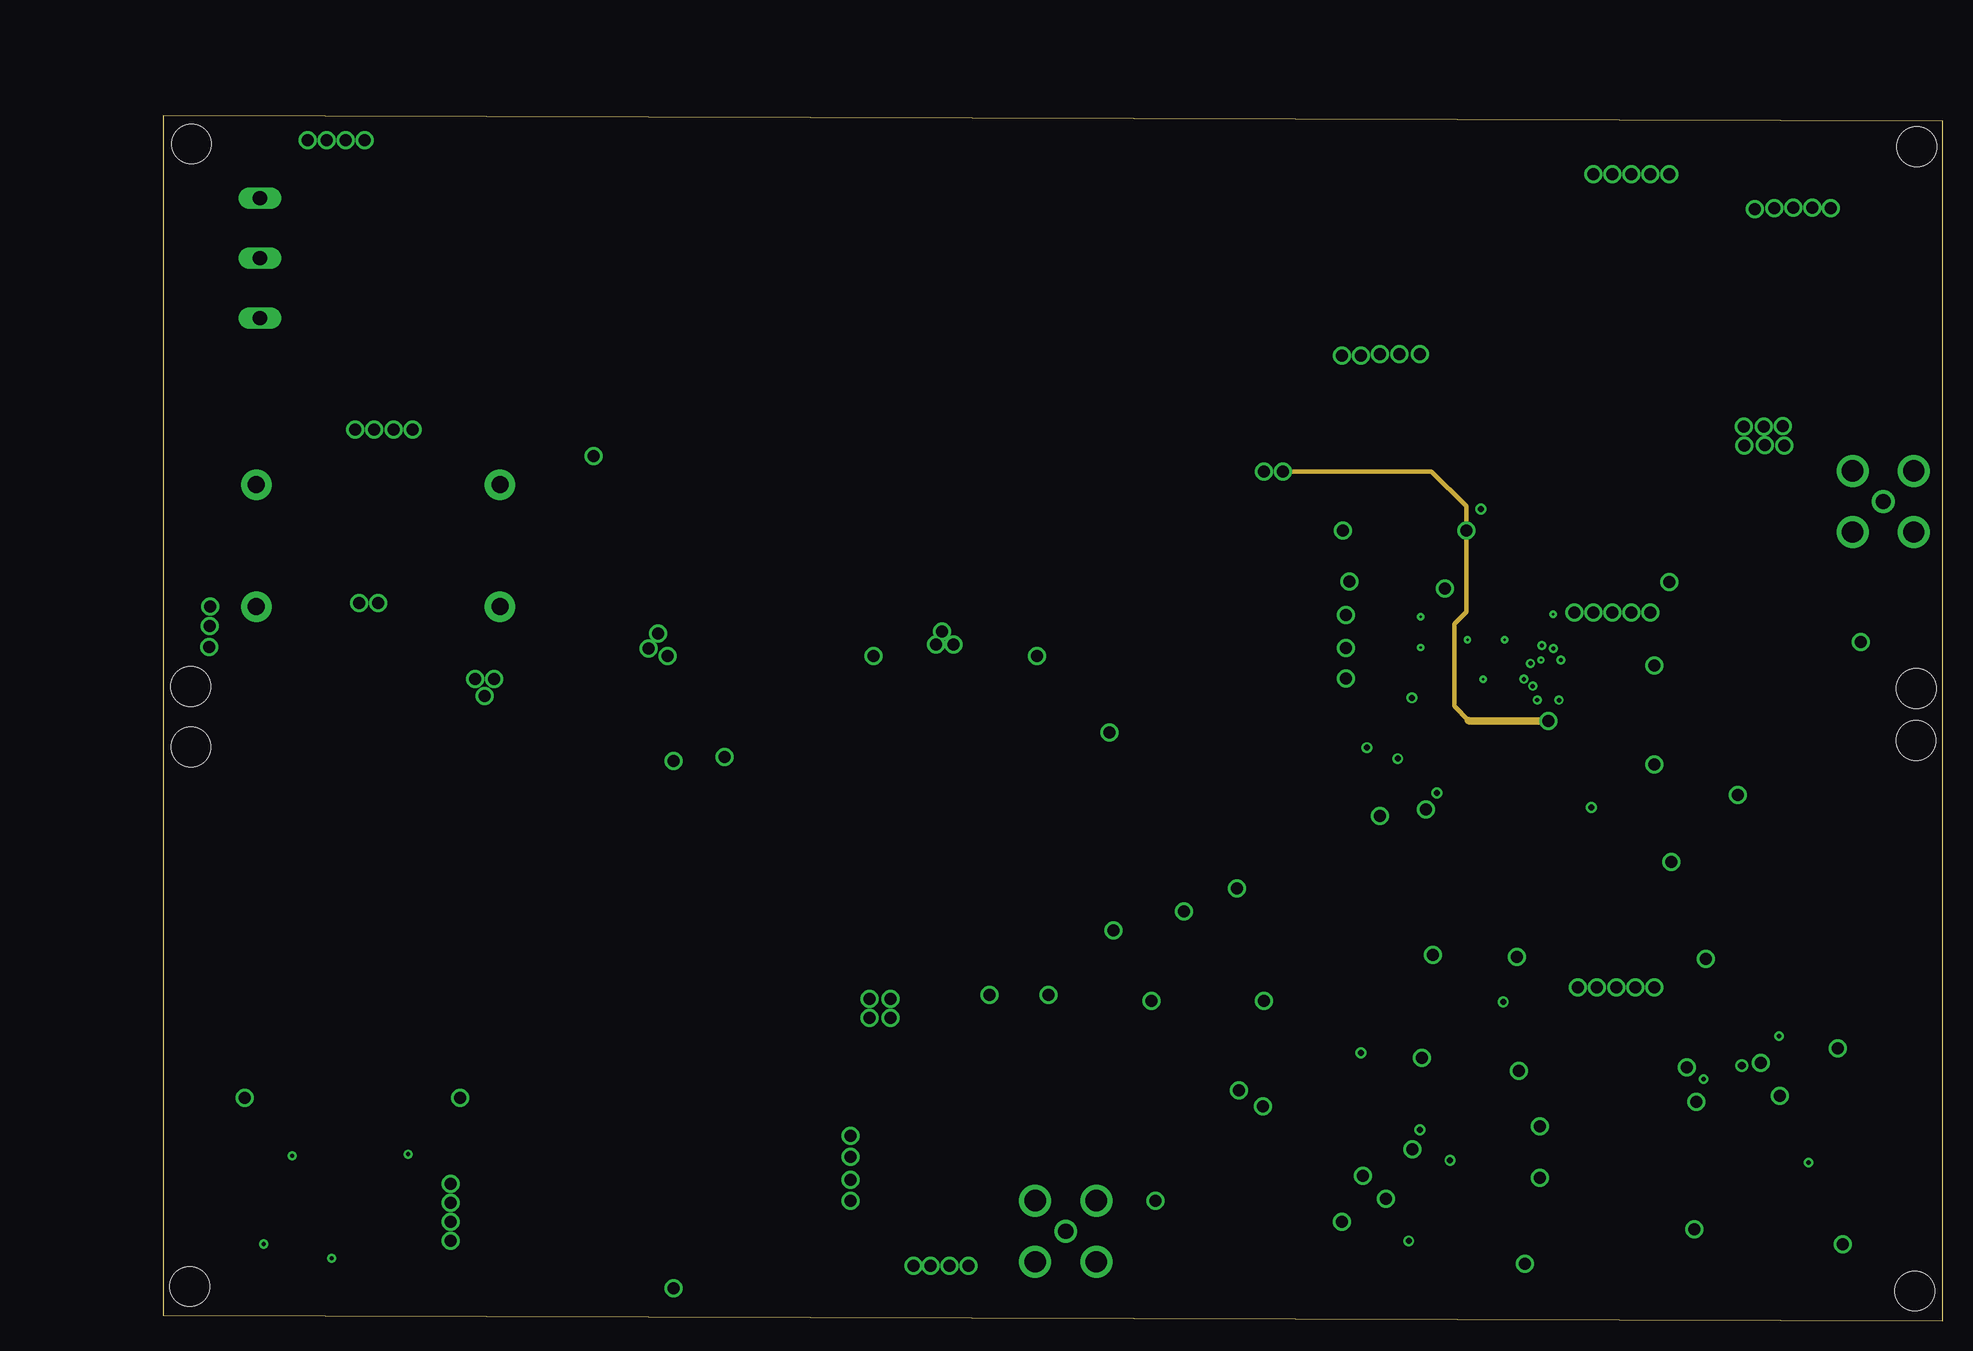
[diagram p6: board, inner layer Route15]
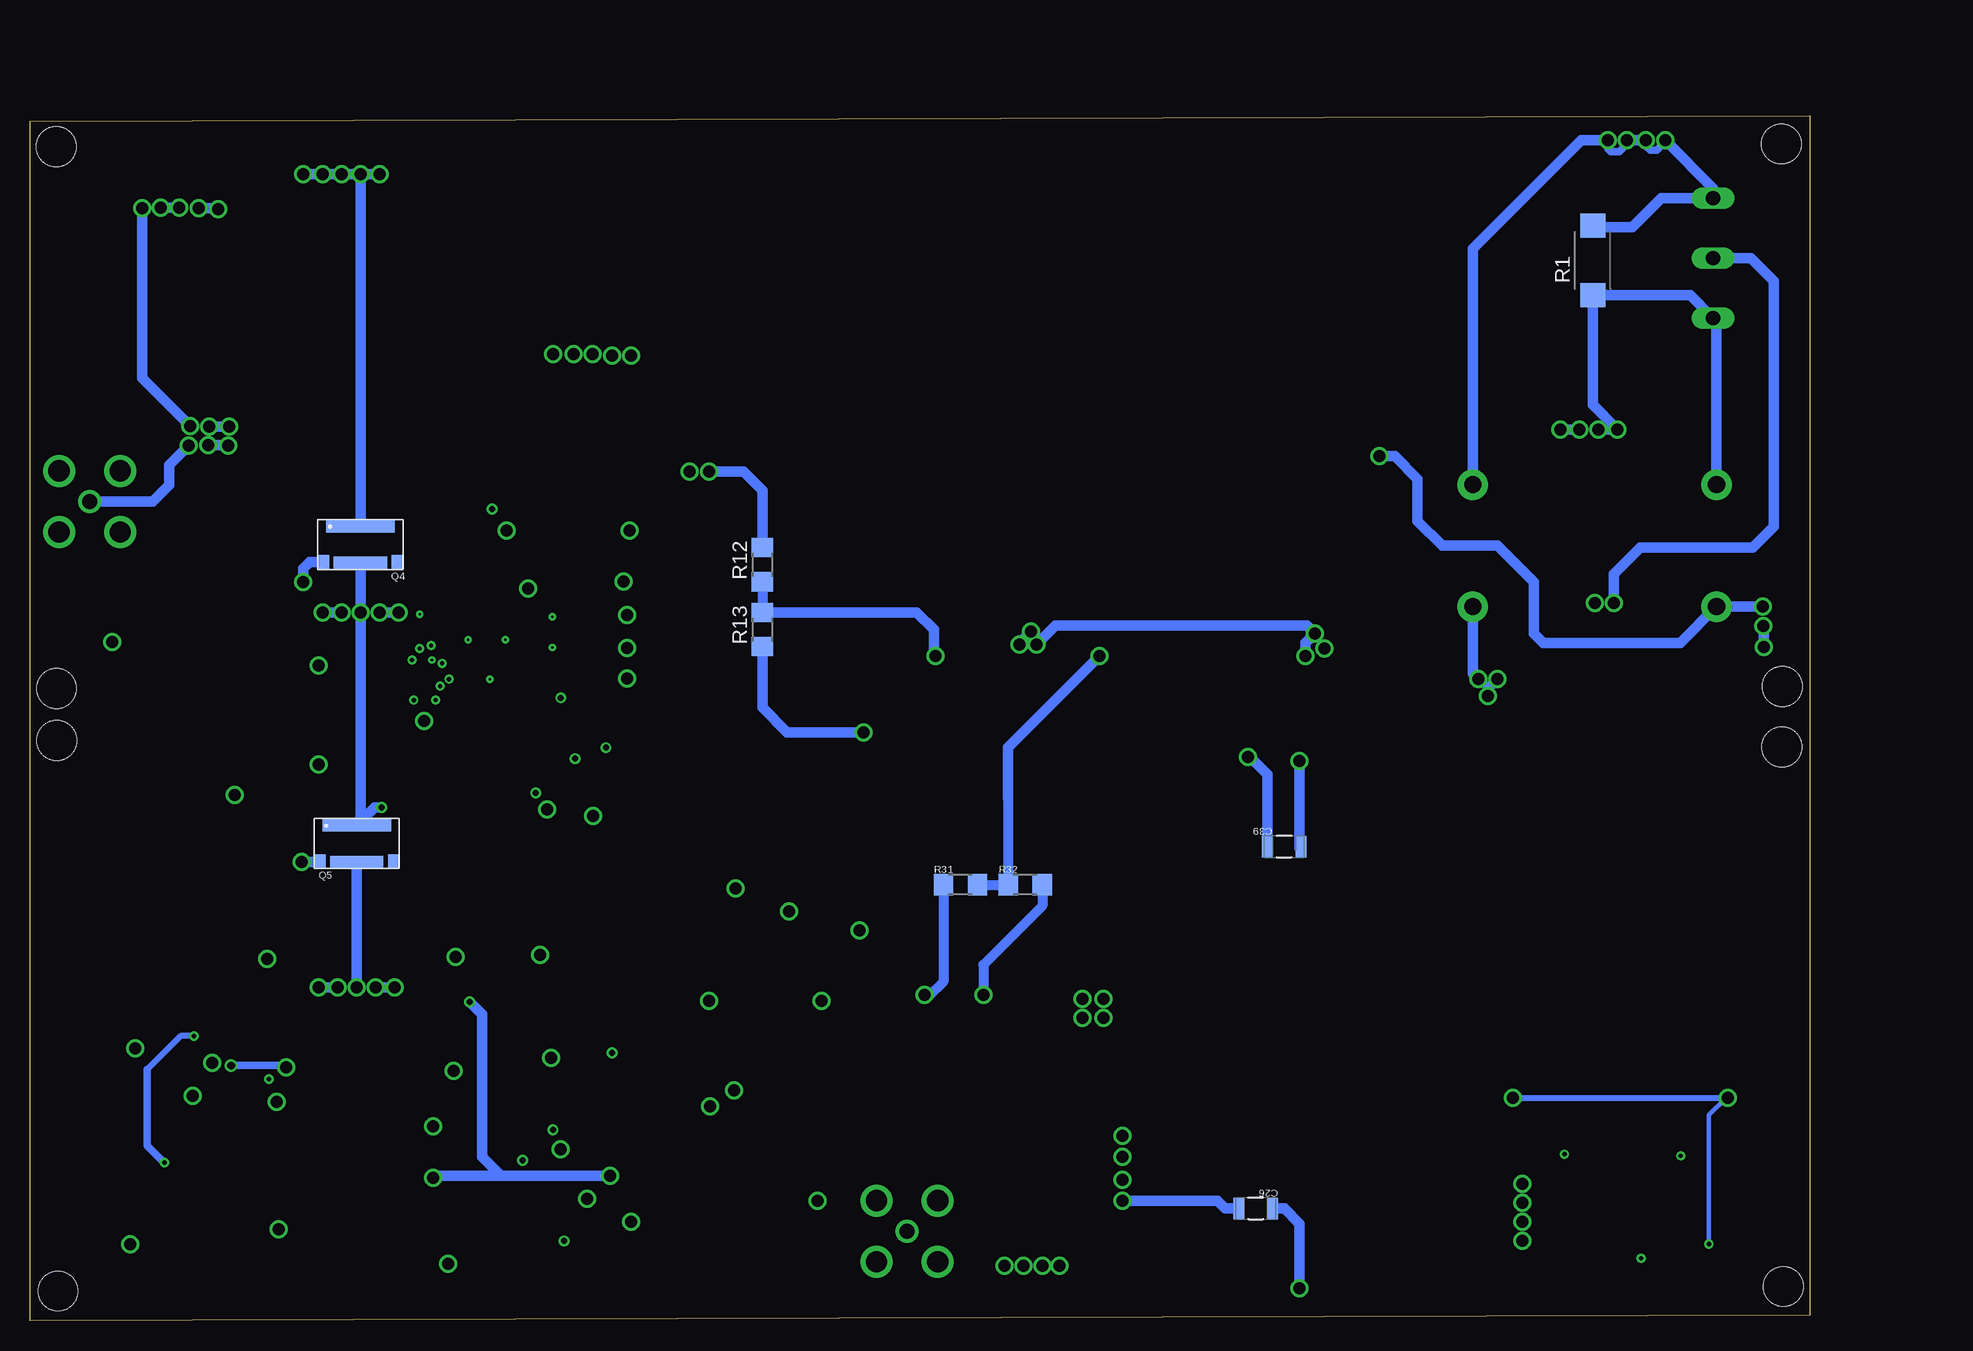
[diagram p7: board, bottom side, seen from below]

Size 148.36 x 100.48 mm. Coordinates in mm from the lower left corner, seen from the top.
Outline: 0,0.48 148.36,0 148.36,100 0,100.48 0,0.48
Copper layers (1+2*3+14*15+16): Top 0.035mm / dielectric 1.5mm / Route2 0.035mm / dielectric 0.15mm / Route3 0.035mm / dielectric 0.2mm / Route14 0.035mm / dielectric 0.15mm / Route15 0.035mm / dielectric 0.2mm / Bottom 0.035mm
Design rules "default *": minimum track width 4mil, minimum drill 0.2mm, track to track 2mil, track to pad 2mil, pad to pad 2mil, via to via 2mil, smd to smd 2mil, copper to edge 3mil, drill to drill 3mil, minimum pad ring 10mil, minimum via ring 8mil, stop-mask expansion 4mil, vias tented up to drill 0mil, thermal gap 10mil
Holes 3.3 mm at 2.38,98.11 2.22,2.86 146.02,2.48 146.18,97.89 2.31,52.88 2.33,47.85 146.15,52.72 146.12,48.38

### Footprints (pad centres in the part's own frame; a part is rotated, then mirrored left to right if it is on the bottom)
CEL-EDH-9R = smd 5.08 x 1.27: 1 9.842,0; 2 -0.318,0
2220 = smd 1.702 x 5.512: 1 0,0; 2 5.08,0
C2220K = smd 1.85 x 5.5: 1 -2.55,0; 2 2.55,0
CEL-EDH-9P = smd 3.683 x 1.143: 1 8.255,0; 2 0.159,0
C2225K = smd 1.85 x 6.8: 1 -2.55,0; 2 2.55,0
CAPC3216X88N = smd 0.914 x 1.803: 1 -1.397,0; 2 1.397,0
CEL-EDK-9B = smd 1.905 x 0.762: 1 2.857,0; 2 0,0
CEL-EDK-9D = smd 2.286 x 0.762: 1 3.651,0; 2 0,0
CEL-EDH-9M = smd 3.81 x 1.27: 1 7.938,0; 2 0.953,0
CST1211 = smd 4.318 x 1.524: 1 0,0; 2 0,-5.08 | smd 2.794 x 1.397: 3 8.89,-6.35; 4 8.89,-3.81; 5 8.89,-1.27; 6 8.89,1.27
SOT23 = smd 1 x 1.4: 1 -0.95,-1.1; 2 0.95,-1.1; 3 0,1.1
SMC = smd 2.8 x 3.8: A 3.7,0; C -3.7,0
SOD123FL = smd 0.91 x 1.22: A 1.625,0; C -1.625,0
TO252 = smd 1 x 1.6: 1 -2.28,-4.8; 2 2.28,-4.8 | smd 5.4 x 6.2: 3 0,2.5
DBZ_R-PDSO-G3 = smd 0.7 x 1: 1 -0.95,-1.1; 2 0.95,-1.1; 3 0,1.1
SO8 = smd 0.6 x 2.2: 1 -1.905,-2.6; 2 -0.635,-2.6; 3 0.635,-2.6; 4 1.905,-2.6; 5 1.905,2.6; 6 0.635,2.6; 7 -0.635,2.6; 8 -1.905,2.6
SOT23-5 = smd 0.55 x 1.2: 1 -0.95,-1.3; 2 0,-1.3; 3 0.95,-1.3; 4 0.95,1.3; 5 -0.95,1.3
PA4342 = smd 4.191 x 3.81: P$1 0,0; P$2 9.525,0
104NLT = smd 12.573 x 3.175: 1 0.318,10.477; 2 0.318,-5.239
CHIPLED_1206 = smd 1.5 x 1.5: A 0,-1.75; C 0,1.75
CMT1-8-1L = drill 1.422 pad 2.54: 1 -3.81,11.43; 2 -3.81,-8.89; 3 6.35,-8.89; 4 6.35,11.43
PA5140.XXXNL = smd 3.251 x 6.452: 1 0,2.54; 2 12.383,2.54; 3 12.383,17.145; 4 0,17.145
61008T = smd 5.715 x 1.016: 1 0,0.508 | smd 0.889 x 1.143: 2 -3.048,-2.477; 4 3.048,-2.477 | smd 4.445 x 1.016: 3 0,-2.54
R2512W = smd 2 x 2.1: 1 -2.896,0; 2 2.896,0
R1206 = smd 1.6 x 1.803: 1 -1.422,0; 2 1.422,0
3223G = smd 2 x 0.9: 1 -2.2,1.4; 3 -2.2,-1.4 | smd 2 x 1.3: 2 2.2,0
TO263-5 = smd 1.067 x 2.159: 1 -3.404,-5.791; 2 -1.702,-5.791; 3 0,-5.791; 4 1.702,-5.791; 5 3.404,-5.791 | smd 10.8 x 10.41: 6 0,2.54
SFCS_SMD = smd 3.81 x 1.93: P$1-NC -12.065,5.08; P$2-VO+ -12.065,2.54; P$3-VO+ -12.065,0; P$4-VO+ -12.065,-2.54; P$5-VO- -12.065,-5.08; P$6-VO- -12.065,-7.62; P$7-NC -12.065,-17.78; P$8-NC 26.035,-17.78; P$9-ALM 26.035,-15.24; P$10-RC 26.035,-12.7; P$11-PO 26.035,-10.16; P$12-NC 26.035,-7.62; P$13-VIN+ 26.035,-5.08; P$14-VIN+ 26.035,-2.54; P$15-VIN- 26.035,0; P$16-VIN- 26.035,2.54; P$17-NC 26.035,5.08
SOIC-4 = smd 1.2 x 1.2: + 1.3,3.05; - -1.3,3.05; ~1 -1.3,-3.05; ~2 1.3,-3.05
SOT765 = smd 0.4 x 0.75: 1 -0.8,-1.375; 4 0.8,-1.375; 5 0.8,1.375; 8 -0.8,1.375 | smd 0.3 x 0.75: 2 -0.25,-1.375; 3 0.25,-1.375; 6 0.25,1.375; 7 -0.25,1.375
BGA20C40P5X4_164X204X28 = smd 0.15 x 0.15: 1 0.8,0.6; 2 0.4,0.6; 3 0,0.6; 4 -0.4,0.6; 5 -0.8,0.6; 6 0.8,0.2; 7 -0.4,0.2; 8 -0.8,0.2; 9 0.8,-0.2; 10 -0.4,-0.2; 11 -0.8,-0.2; 12 0.8,-0.6; 13 0.4,-0.6; 14 0,-0.6; 15 -0.4,-0.6; 16 -0.8,-0.6
BU-SMA-V = drill 1.27: 1 0,0 | drill 1.778: 2 -2.55,2.55; 3 2.55,2.55; 4 2.55,-2.55; 5 -2.55,-2.55
W237-103 = drill 1.194 long: 1 -5,-1.29; 2 0,-1.29; 3 5,-1.29

### Placement (x,y rotation side)
C1  108.43,86.37 90 top
C2  11.75,76.68 180 top
C3  38.26,90.49 90 top
C4  139.15,79.25 90 top
C5  94.46,86.37 90 top
C6  80.49,86.37 90 top
C7  52.39,77 0 top
C8  134.52,87.75 270 top
C9  127.44,87.8 270 top
C10  132.66,79.46 90 top
C11  142.58,87.52 270 top
C12  86.68,36.04 0 top
C13  83.03,75.89 0 top
C14  100.5,65.87 0 top
C15  119.06,35.57 0 top
C16  107.19,73.16 270 top
C17  32.7,50.65 0 top
C18  44.45,68.43 270 top
C19  101.78,61.62 0 top
C20  17.3,44.3 0 top
C21  6.83,44.3 0 top
C22  17.3,51.6 0 top
C23  6.83,51.6 0 top
C24  13.49,21.44 0 top
C25  12.54,33.34 0 top
C26  46.2,9.37 180 bottom
C27  69.85,20.49 0 top
C28  91.44,11.91 0 top
C29  90.17,6.83 90 top
C30  113.03,17.63 270 top
C31  109.86,30.01 0 top
C32  111.76,6.2 90 top
C33  106.05,25.25 270 top
C34  104.78,18.42 90 top
C35  104.14,11.6 90 top
C36  102.87,44.3 180 top
C37  108.27,40.17 180 top
C38  103.5,31.28 270 top
C39  43.81,39.54 180 bottom
C40  67.31,23.34 180 top
C41  108.27,37.95 180 top
C42  38.26,81.45 90 top
C43  45.56,90.49 90 top
C44  45.56,81.45 90 top
C45  54.13,89.22 90 top
C46  66.52,86.37 90 top
C47  112.45,51.06 270 top
C48  84.45,24.3 90 top
C49  82.23,34.77 180 top
C50  93.98,23.34 270 top
C51  92.71,30.96 270 top
C52  96.84,34.14 0 top
C53  96.2,23.34 90 top
C54  136.05,21.12 180 top
C55  133.83,15.09 90 top
C56  134.62,38.9 180 top
C57  128.11,15.25 90 top
C58  131.92,7.47 90 top
CT1  136.11,69.21 270 top
D1  121.3,31.83 0 top
D3  114.77,59.99 270 top
D5  72.71,51.28 0 top
D6  60.64,51.28 0 top
DZ1  11.53,5.2 0 top
DZ2  18.2,5.12 0 top
DZ3  102.44,71.4 90 top
IC1  64.61,11.28 180 top
IC2  93.34,6.83 90 top
IC3  109.86,33.82 270 top
IC4  107.31,11.6 0 top
IC5  88.9,30.96 0 top
IC8  136.05,23.66 90 top
IC9  102.87,46.84 90 top
IC10  108.58,18.58 180 top
L1  120.78,69.67 90 top
L3  88.09,62.53 180 top
L4  70.8,37 90 top
LED1  137,4.93 90 top
LF1  16.67,65.89 270 top
LF2  18.06,76.43 0 top
Q1  13.25,14.93 0 top
Q2  8.89,14.93 0 top
Q3  18.41,14.93 0 top
Q4  120.81,65.73 0 bottom
Q5  121.13,40.81 0 bottom
R1  18.1,88.39 90 bottom
R2  6.83,32.87 90 top
R3  124.46,35.41 0 top
R4  141.4,60.97 90 top
R5  120.97,48.9 0 top
R6  120.97,46.36 0 top
R7  120.97,52.08 0 top
R8  120.97,54.62 0 top
R9  41.27,73.51 270 top
R10  39.05,73.51 270 top
R11  136.21,35.41 90 top
R12  87.31,63.03 90 bottom
R13  87.31,57.63 90 bottom
R14  101.89,58.83 0 top
R15  101.91,56.14 180 top
R16  101.91,53.52 0 top
R17  111.58,59.63 270 top
R18  106.2,64.47 270 top
R19  6.83,23.34 270 top
R20  85.72,6.83 180 top
R21  51.75,52.71 270 top
R22  14.48,9.56 270 top
R23  8.72,9.48 270 top
R24  87.95,11.6 90 top
R25  11.77,9.51 270 top
R26  17.27,9.58 270 top
R27  20.12,9.53 270 top
R28  96.52,6.83 270 top
R29  113.03,37.95 180 top
R30  45.24,52.55 270 top
R31  70.8,36.36 0 bottom
R32  65.41,36.36 0 bottom
R33  107.31,5.56 0 top
R34  107.31,7.79 180 top
R35  102.23,18.58 270 top
R36  111.76,10.64 270 top
R37  108.9,25.25 90 top
R38  99.62,18.59 270 top
R39  107.63,48.11 180 top
R41  107.63,45.57 0 top
R42  102.87,37 180 top
R43  102.87,34.46 180 top
R44  107.17,53.52 180 top
R45  145,79.28 270 top
R46  144.89,60.95 270 top
R47  88.19,21.76 0 top
R48  82.39,32.55 180 top
R49  88.19,24.93 180 top
R50  81.92,29.69 180 top
R51  91.76,23.34 90 top
R52  96.52,31.28 180 top
R53  96.52,28.42 180 top
R54  95.25,19.53 0 top
R55  138.59,9.69 270 top
R56  136.05,9.69 90 top
R57  137.32,15.72 90 top
R58  108.76,59.58 90 top
R59  117.63,90.65 270 top
R60  134.3,49.7 180 top
R61  134.94,29.38 270 top
R62  131.6,24.45 270 top
R63  129.06,24.45 90 top
R64  130.81,15.41 270 top
R65  131.6,4.93 0 top
R66  85.09,11.6 270 top
R67  53.98,85.26 0 top
R68  133.67,35.41 90 top
REG1  71.44,63.35 0 top
REG2  57.47,63.35 0 top
U1  47.62,31.76 270 top
U2  134.62,43.66 180 top
U3  131.29,19.53 90 top
U4  115.89,53.51 0 top
X1  75.25,7.47 0 top
X2  143.39,68.3 180 top
X5  9.37,88.59 270 top

### Tracks (layer width: path | path; a pad name or v marks a point on that pad's centre or on a via)
+5V  (via drill 1)
  Top 0.203: v127.79,18.26 127.79,18.36 | 127.79,18.36 127.79,18.8 128.27,19.28 U3.7 | U3.8 128.16,18.73 127.79,18.36 | R64.1 129.78,16.83 129.59,16.64 C57.2 127.81,16.95 127.81,18.25
  Top 0.305: U3.2 134.24,19.28 134.65,18.87
  Top 0.508: C12.2 88.08,35.09 88.27,34.9 IC5.7 | IC4.5 104.24,12.89 C35.2 v104.14,14.29 | IC10.7 109.22,17.31 109.86,17.94 111.32,17.94 C30.2 113.06,16.2 v114.78,16.2 | IC9.5 101.57,44.39 C36.2 101.47,42.11 v101.44,42.08 | IC3.7 110.81,34.45 110.49,34.14 110.49,30.77 C31.2 111.57,30.33 v112.87,30.33 | IC8.5 134.75,21.22 C54.2 134.65,18.87 v134.78,18.74 | LED1.A 138.75,8.11 R55.2 140.02,6.84 v140.02,6.4 | 127.81,18.25 v127.79,18.26
  Top 0.889: IC1.2 59.37,19.04 C40.1 59.37,23.98 v60.64,25.25 | v58.9,25.25 v58.9,26.83 | C12.2 v89.53,36.04 | R66.2 84.92,10.01 v82.71,10.01
  Route14 0.508: v82.71,10.01 82.71,12.23 84.77,14.29 v104.14,14.29 113.67,14.29 114.78,15.4 v114.78,16.2 | v101.44,42.08 101.28,41.92 | 101.28,41.92 95.41,36.04 v89.53,36.04 | v112.87,30.33 112.87,37.79 111.76,38.9 102.39,38.9 101.28,40.01 101.28,41.92 | v127.79,18.26 134.3,18.26 v134.78,18.74 134.78,11.61 139.99,6.4 v140.02,6.4
  Route14 0.635: v114.78,16.2 116.84,18.26 v127.79,18.26
  Route14 0.889: v60.64,25.25 60.01,25.25 | 60.01,25.25 v58.9,25.25 | v58.9,26.83 v60.64,26.83 60.64,34.14 62.55,36.04 v89.53,36.04 | v82.71,10.01 82.71,13.82 78.9,17.63 63.18,17.63 60.01,20.8 60.01,25.25
+6V  (via drill 1, 1 pad 0.03)
  Top 0.178: U4.14 U4.15 v115.49,50.02 v115.49,50.01
  Top 0.381: R18.1 103.96,65.89 103.94,65.87 C14.1 103.36,61.8 C19.2 | v91.76,70.81 v93.36,70.81 v93.37,70.82
  Top 0.635: R18.1 | R18.1 v108.64,65.89 | C47.2 112.81,49.3 114.78,49.3 v115.49,50.01
  Top 0.889: v91.76,70.81 91.76,75.41 C13.1 89.38,75.89 87.31,73.83 87.77,73.37 L3.2
  Route15 0.381: v93.37,70.82 105.74,70.82 108.64,67.92 v108.64,65.89 108.64,59.08 107.64,58.09 107.64,51.25 108.83,50.06
  Route15 0.635: 108.83,50.06 108.88,50.01 v115.49,50.01
  Bottom 0.889: R12.2 87.31,69.22 88.9,70.81 v91.76,70.81
+12V  (via drill 1)
  Top 0.813: R21.2 50.16,48.23 U1.P$2-VO+ U1.P$3-VO+ U1.P$4-VO+ 45.09,49.22 45.09,49.5 R30.2 44.25,50.65 C17.1
  Top 0.889: v46.83,47 45.09,48.74 45.09,49.22
  Bottom 0.889: C39.2 45.21,45.54 46.67,47 v46.83,47
  pour Top (hatched): 39.37,51.6 52.55,51.6 53.02,51.12 53.02,50.17 53.02,48.9 52.55,48.43 51.59,48.43 51.44,48.27 50.96,47.79 50.96,41.28 44.29,41.28 44.29,47.95 43.66,48.58 43.5,48.74 39.53,48.74 38.89,49.38 38.89,49.54 38.89,51.12
+48V  (via drill 1)
  Top 0.889: C2.2 6.67,77.64 13.02,83.98 13.02,91.45 15.52,93.95 17.68,93.95 LF2.4 17.27,93.57 15.24,95.61 v15.24,98.43
  Bottom 0.635: 8.64,93.68 8.31,93.35 | v13.65,98.43 13.65,97.93 13.31,97.59 12.78,97.59 12.06,98.3 v12.06,98.43 | v16.83,98.43 16.83,97.7 16.59,97.46 15.9,97.46 15.24,98.12 v15.24,98.43
  Bottom 0.889: LF1.1 28.1,89.38 19.05,98.43 v16.83,98.43 | v15.24,98.43 v13.65,98.43 | v12.06,98.43 8.08,94.44 X5.1 | 8.31,93.35 X5.1 | X5.1 12.38,93.59 14.78,91.19 18,91.19 R1.2
+48V(RTN)  (via drill 1)
  Top 0.889: v16.03,74.3 18.1,76.36 18.1,78.93 LF2.1 | v17.62,74.3 v19.21,74.3 | v20.8,74.3 14.92,74.3 12.86,76.36 12.22,76.36 12.22,77.16 C2.1
  Bottom 0.889: LF1.2 7.78,83.29 X5.3 9.98,85.5 R1.1 18.1,76.36 v16.03,74.3 v17.62,74.3 | v19.21,74.3 v20.8,74.3
AGND  (via drill 0.35, 1)
  Top 0.381: R27.1 20.12,11.99 19.36,12.74 Q3.2 19.43,13.89 v20.45,13.89 | Q2.2 10.71,13.83 v10.77,13.77 | DZ1.A v14.06,5.2 v14.07,5.21
  Top 0.508: C24.2 15.08,21.44 18.1,18.42 21.59,18.42 23.81,16.2
  Top 0.813: C23.1 6.83,54.8 3.9,57.73 | 50.16,5.88 50.09,5.8 U1.P$16-VIN- | R9.2 R10.2
  Top 0.889: 23.81,16.2 23.97,16.04 v23.97,11.44 | 50.16,5.88 50.16,9.05 51.12,10.01 v57.31,10.01 | v35.88,72.08 v35.88,72.09 R10.2 | v3.92,59.54 3.92,56.25 v3.84,56.18 | v3.9,57.91 3.9,57.73 | C23.1 6.83,45.09 6.51,44.77 6.51,44.62 C21.1 6.83,41.12 4.29,38.58 4.29,31.28 6.19,29.37 6.83,29.37 | R2.1 6.83,29.37 | 6.83,29.37 R19.1 9.96,26.24 11.27,24.93 11.27,22.39 12.22,21.44 C24.2
  Route2 0.381: 23.18,13.82 23.1,13.89 v20.45,13.89 20.32,13.77 v10.77,13.77 12.22,13.77 14.07,11.91 v14.07,5.21
  Route2 0.508: v23.97,11.44 23.97,13.02 23.18,13.82
  Route2 0.889: v57.31,15.4 v57.31,13.66 | v57.31,13.66 v57.31,11.75 v57.31,10.01 | v23.97,11.44 v23.97,9.85 v23.97,8.26 v23.97,6.67 30.96,13.66 v57.31,13.66
  Bottom 0.889: C26.2 48.74,9.37 49.37,10.01 v57.31,10.01 | v3.92,59.54 LF1.3 10.79,56.52 22.23,56.52 23.02,57.32 23.02,61.6 26.04,64.62 30.64,64.62 32.7,66.68 32.7,70.17 34.61,72.08 v35.88,72.08 | v3.84,56.18 3.84,57.91 v3.9,57.91
CT+
  Top 0.889: CT1.4 132.3,51.06 132.56,50.81
  Top 1.27: 132.56,50.81 131.44,49.69 R60.2 133.32,47.78 U2.~2
CT-
  Top 0.889: 135.48,51.54 135.48,59.68 CT1.5
  Top 1.27: 135.48,51.54 136.84,50.17 136.84,48.9 135.92,47.98 | U2.~1 135.92,47.98 | 135.92,47.98 135.92,48.42 R60.1
DGND  (via drill 0.35, 0.5 pad 0.03, 1, 1 pad 0.03)
  Top 0.178: U4.13 116.29,51.82 v116.37,51.74 | U4.11 114.57,53.3 v114.17,52.91
  Top 0.305: U3.4 133.19,20.86 v133.19,21.51
  Top 0.381: IC9.2 102.95,46.84 v102.92,46.86 | R58.2 106.89,61 v106.86,61.04 | C47.1 113.72,52.46 v114.17,52.91 | C19.1 100.33,61.67 100.33,62.38 100.5,62.55 C14.2 98.39,65.87 v98.37,65.89 | C19.1 100.38,58.91 R14.1 | R14.1 100.46,56.17 R15.2 | R15.2 R16.1 | R16.1 100.49,52.91 100.43,52.86 100.43,53.46 R16.1 | C19.1 v98.88,61.62 | R16.1 98.63,53.52 v98.6,53.54 | R14.1 v98.6,58.83 | R15.2 98.64,56.14 v98.6,56.11 | IC4.2 107.31,13.36 v107.29,13.39
  Top 0.508: R51.1 91.78,21.95 C50.2 93.83,21.79 R54.1 | C49.1 84.9,36.04 C12.1 | R28.1 95.1,6.83 IC2.3 92.25,11.11 C28.2 | C33.2 106.05,22.71 106.68,22.07 IC10.4 105.95,21.91 v104.93,21.91 | C31.1 108.46,31.41 107.95,31.92 IC3.4 106.05,31.92 105.86,31.73 v105.86,30.49 | C56.1 136.02,37.02 R11.2 | IC5.4 90.81,27.63 v91.76,26.68 | IC8.2 138.75,23.66 139.6,22.8 v139.6,22.7 | C58.2 135.25,7.47 R56.1 135.25,7.47 127.79,7.47 v127.64,7.63 128.11,8.1 C57.1 | R63.2 128.59,26.35 v128.59,30.17
  Top 0.813: 37.94,81.45 38.42,81.45 | C1.2 C5.2 C6.2 | 51.91,77 C7.2 53.34,77 53.34,77.32 55.56,79.54 70.33,79.54 76.2,79.54 | 51.44,77 50.48,77 | U1.P$5-VO- U1.P$6-VO- 37.31,43.82 36.2,44.93 36.2,49.69 35.24,50.65 C17.2 32.07,50.65 31.75,50.97 31.75,51.28 33.97,51.28 36.83,54.14 36.83,63.35 41.75,68.27 C18.2 44.45,70.33 47.31,73.19 47.31,75.41 48.5,76.6 | 64.34,51.44 D6.A 64.34,45.04 67.63,41.76 67.63,25.88 | 67.63,25.88 67.63,23.66 | 67.63,23.66 67.31,23.34 C40.2 | C27.2 70.01,22.23 68.58,23.66 67.63,23.66 | v68.9,27.15 67.63,25.88 | D5.A 76.41,54.03 79.38,57 79.38,70.01 81.76,72.4 | R9.1 R10.1 | C48.2 83.38,25.69 v82.39,26.68 | R54.1 92.23,19.53 91.68,18.98 v91.68,17.87 | C49.1 84.45,34.77 v85.09,34.14 | C38.2 105.26,29.88 v105.86,30.49
  Top 0.889: 145.22,84.45 144.76,84.54 | 144.76,84.54 C11.2 142.35,85.2 C8.2 | U2.- 135.92,39 C56.1 | U1.P$5-VO- v42.55,46.68 | C30.1 v113.03,20.83 | C54.1 139.02,21.12 139.6,21.7 v139.6,22.7 | 60.87,56.92 60.87,51.85 61.44,51.28 D6.A | 76.2,79.54 79.53,79.54 C13.2 83.19,73.83 81.76,72.4 | v78.9,49.06 76.99,50.97 76.99,51.28 D5.A | REG2.3 57.47,63.98 | 57.47,63.98 57.47,65.57 | C18.2 54.77,68.27 57.47,65.57 | REG2.5 60.87,63.28 60.17,63.98 57.47,63.98 | REG2.6 57.47,65.57 | R28.1 v98.26,8.25 v98.27,8.26 | C32.1 113.47,4.8 v113.51,4.77 | v101.92,10.17 101.95,10.2 C35.1 | C36.1 104.27,43.83 105.25,42.84 v105.25,42.64 | C40.2 65.88,22.87 65.72,22.87 64.61,21.76 64.61,9.05 65.41,9.05 67.15,7.31 v67.15,4.61 72.39,4.61 X1.5 | IC1.3 62.55,6.71 v62.55,4.61 | v63.98,4.61 v65.56,4.61 | 37.94,81.45 32.92,81.45 LF2.2 | C44.1 C42.1 39.05,80.65 | 38.42,81.45 39.05,80.81 39.05,80.65 | 39.05,80.65 R10.1 | C44.1 48.42,81.45 51.08,84.11 R67.1 54.29,88.47 54.29,90.34 53.98,90.65 53.98,90.34 C45.2 | C44.1 50.01,77 C7.2 52.15,76.6 50.01,76.6 | 51.91,77 51.44,77 50.41,77 50.01,76.6 | 48.5,76.6 50.01,76.6 | 54.29,91.45 75.09,91.45 C6.2 73.98,79.54 70.33,79.54 71.44,78.43 REG1.3 71.44,61.92 72.71,63.19 73.41,63.19 74.84,61.76 | REG1.5 74.84,61.76 | 74.84,61.76 74.84,62.48 REG1.6 | 120.52,27.79 v121.13,27.79 v122.71,27.79 | 120.52,27.79 v119.54,27.79 v117.95,27.79 | C15.1 117.67,31.74 118.67,30.73 D1.1 120.35,27.96 120.52,27.79 | 128.14,85.24 128.04,85.34 120.05,85.34 R59.2 115.93,86.05 C1.2 108.33,85.95 108.33,82.45 106.45,80.57 v104.78,80.57 | 128.14,85.24 127.45,85.24 C9.2 134.47,85.25 C8.2 | C10.2 132.3,82.37 129.01,82.37 128.14,83.24 128.14,85.24
  Top 0.889: C4.2 137.32,83.64 135.28,83.64 134.52,84.4 C8.2 | R45.1 145,84.31 144.76,84.54 | X2.4 X2.5 X2.2 | X2.2 X2.3 | v98.27,80.47 v99.85,80.47 | v101.45,80.57 v103.05,80.57 | R46.1 144.89,64.7 X2.2
  Top 1.27: U2.- 135.92,42.52 134.62,43.82 v131.29,43.82
  Route2 0.381: v105.25,42.64 103.84,42.64 102.92,43.56 v102.92,46.86 102.92,49.73 101.78,50.88 99.31,50.88 98.6,51.59 v98.6,53.54 v98.6,56.11 v98.6,58.83 98.6,61.34 v98.88,61.62 | v114.17,52.91 115.2,52.91 v116.37,51.74 117.73,53.1 117.73,57 117.17,57.56 114.3,57.56 110.82,61.04 v106.86,61.04 102.82,61.04 102.23,61.62 v98.88,61.62 | v98.37,65.89 98.88,65.38 v98.88,61.62 | v107.29,13.39 104.07,10.17 v101.92,10.17
  Route2 0.813: v91.68,17.87 91.76,17.94 v91.76,26.68 v82.39,26.68 82.39,31.44 v85.09,34.14
  Route2 0.889: v91.76,26.68 104.62,26.68 105.86,27.92 v105.86,30.49 105.25,31.1 v105.25,42.64 | v98.27,8.26 98.27,16.04 96.36,17.94 91.76,17.94 | v98.27,8.26 98.27,5.72 99.22,4.77 v113.51,4.77 113.03,5.25 v113.03,20.83 111.94,21.91 v104.93,21.91 | v98.27,8.26 100.01,8.26 v101.92,10.17 | v139.6,22.7 139.6,21.69 139.04,21.12 133.58,21.12 v133.19,21.51 | v127.64,7.63 132.08,7.63 133.19,8.74 v133.19,21.51 | v62.55,4.61 v63.98,4.61 | v65.56,4.61 v67.15,4.61 | v128.59,30.17 131.29,32.87 v131.29,43.82 131.29,61.56 135.46,65.74 140.85,65.74 | v128.59,30.17 131.13,30.17 133.19,28.1 v133.19,21.51 | v98.37,65.89 98.37,80.37 v98.27,80.47 | v99.85,80.47 101.35,80.47 v101.45,80.57 | v103.05,80.57 v104.78,80.57 139.5,80.57 140.84,79.23 X2.4 141.95,71.96 145.09,71.96 146.25,70.79 146.25,66.09 145.9,65.74 140.85,65.74 | 140.85,65.74 X2.3 | v128.59,30.17 126.68,30.17 v124.3,27.79
  Route3 0.813: 91.76,17.79 90.81,16.83 84.61,16.83 X1.3 X1.4 X1.5 X1.2 72.7,11.9 81.92,21.12 90.96,21.12 91.76,20.33 91.76,17.79 | 91.76,17.79 v91.68,17.87
  Bottom 0.813: R32.2 63.98,34.61 68.9,29.69 v68.9,27.15
  Bottom 0.889: v42.55,46.68 42.55,39.41 C39.1 | R13.1 87.31,51.12 85.25,49.06 v78.9,49.06 | Q5.3 v121.13,27.79 | v119.54,27.79 v117.95,27.79 | v122.71,27.79 v124.3,27.79
  pour Top (hatched): 60.64,58.74 60.64,54.78 59.85,53.98 59.85,50.81 63.82,46.84 63.82,15.25 64.93,15.25 64.93,17.95 66.04,19.06 70.48,19.06 71.75,20.33 71.91,20.33 71.91,24.93 72.07,25.09 70.17,26.99 70.17,43.66 65.88,47.95 65.88,53.19 65.25,53.82 64.45,53.82 62.55,55.73 62.55,58.59 62.39,58.74
EN  (via drill 0.2 pad 0.03, 0.38)
  Top 0.102: U4.7 115.49,53.82 115.28,54.02 115.28,54.21 114.86,54.64 v114.86,55.09
  Top 0.305: U3.5 128.59,20.33 v128.43,20.17
  Top 0.381: R58.1 108.76,56.79 v108.74,56.77
  Route3 0.381: v108.74,56.77 109.75,55.75 114.2,55.75 v114.86,55.09
  Route3 0.635: 117.83,48.59 117.83,52.12 v114.86,55.09
  Route3 0.889: v128.43,20.17 128.43,26.94 116.71,38.66 116.71,47.47 117.83,48.59
HSB  (via drill 0.2 pad 0.03, 0.35, 0.5 pad 0.03)
  Top 0.203: 115.89,56.01 U4.3
  Top 0.305: D3.3 115.89,59.97 115.89,58.92 v115.88,58.9 | v115.89,56.04 115.89,56.01
  Top 0.889: DZ3.C 106.93,69.77 C16.1 108.01,69.51 v109.86,67.67
  Route3 0.305: v115.88,58.9 115.88,56.06 v115.89,56.04
  Route3 0.889: v109.86,67.67 113,67.67 115.88,64.8 v115.88,58.9
HSS  (via drill 0.35, 0.5 pad 0.03, 1)
  Top 0.203: U4.2 116.29,54.86 v116.52,55.09
  Top 0.889: v119.22,59.06 v120.81,59.06 v122.4,59.06 | v123.98,59.06 121.6,61.44 121.6,62.38 | 121.6,62.38 121.6,63.19 | DZ3.A 107.05,73.02 C16.2 117.31,73.16 119.13,71.35 | 119.13,71.35 119.86,70.62 | D1.3 124.6,32.93 125.88,34.21 R3.2 127.46,35.41 127.89,35.84 127.89,40.06 125.15,42.8 v119.05,42.8 | 119.13,71.35 119.13,71.32 L1.P$1 120.78,62.2 | 120.78,62.2 v117.63,59.06 | 121.6,62.38 120.95,62.38 120.78,62.2
  Route3 0.203: v116.52,55.09 116.52,57.95 v117.63,59.06
  Bottom 0.889: Q4.3 v120.81,59.06 120.81,41.63 Q5.1 119.64,42.8 v119.05,42.8 | v117.63,59.06 v119.22,59.06 | v122.4,59.06 v123.98,59.06
HVIN  (via drill 1)
  Top 0.813: C46.1 C6.1 C5.1 C1.1
  Top 0.889: C1.1 111.09,93.55 R59.1 117.63,93.99 v119.22,95.57 | C46.1 65.56,97.16 C45.1 53.98,97 51.75,97 50.32,95.57 C43.2 C3.2 32.44,95.57 LF2.3 | v120.81,95.57 v122.4,95.57 | v123.98,95.57 v125.57,95.57
  Bottom 0.889: Q4.1 v120.81,95.57 | v122.4,95.57 v123.98,95.57 | v125.57,95.57 v119.22,95.57
N$1
  Top 0.889: C25.2 8.1,33.34 6.83,34.61 R2.2
N$2
  Top 0.508: R68.1 133.67,31.71 R61.3
N$3  (via drill 1 pad 0.03)
  Top 0.889: R45.2 144.68,76.7 C4.1 | C10.1 137.66,76.91 137.69,76.94 138.92,76.94 C4.1 | C9.1 132.85,90.35 132.97,90.47 134.34,90.47 C8.1 | C8.1 142.35,90.3 C11.1 | C4.1 136.11,73.66 CT1.1 136.13,69.23 136.72,68.64 | X2.1 137.06,68.3 136.72,68.64 | R4.2 140.64,63.14 138.1,63.14 136.72,64.52 136.72,68.64 | C8.1 134.31,90.5 v134.31,92.74 | v132.69,92.68 132.79,92.79 v135.91,92.79 | v137.47,92.79 138.96,92.79 v139.01,92.74 | v135.03,74.6 134.98,74.55 v133.43,74.55 | v131.78,74.55 131.78,73 v131.83,72.95 | v133.5,73 135.08,73 v135.13,72.95
  Bottom 0.889: v134.31,92.74 132.74,92.74 v132.69,92.68 | v135.91,92.79 v137.47,92.79 | v139.01,92.74 139.01,78.59 v135.03,74.6 | v133.43,74.55 v131.78,74.55 | v131.83,72.95 131.88,73 v133.5,73 | v135.13,72.95 136.75,71.32 136.75,69.67 138.12,68.3 X2.1
N$4
  Top 0.889: C15.2 122.88,35.57 R3.1
N$5  (via drill 1)
  Top 0.813: C7.1 63.18,77 64.45,75.73 64.45,58.9 65.8,57.56
  Top 0.889: R30.1 42.11,55.45 v42.07,55.41 | 65.01,57.56 v64.93,57.47 | 40.48,56.2 41.27,57 v41.27,57.32 41.27,56.68 40.8,56.2 40.48,56.2 | 40.48,56.2 v40.48,56.04 | 65.8,57.56 65.88,57.47 66.67,57.47 66.76,57.56 REG1.1 67.08,57.56 v65.88,56.36
  Bottom 0.889: v42.07,55.41 42.07,56.52 v41.27,57.32 41.91,57.95 62.87,57.95 v64.45,56.36 64.93,56.84 v64.93,57.47 65.88,56.52 v65.88,56.36
  pour Top (hatched): 46.83,53.98 40.01,53.98 39.53,54.46 39.21,54.78 39.21,57.79 39.85,58.43 40.16,58.43 41.91,58.43 43.97,56.36 44.13,56.2 46.83,56.2 47.31,55.73 47.31,54.93 47.31,54.46
N$6  (via drill 1)
  Top 0.889: REG1.4 73.14,55.68 v72.87,55.41
  Bottom 0.813: R12.1 R13.2
  Bottom 0.889: R13.2 74.45,59.05 73.03,57.63 73.03,55.41 v72.87,55.41
N$7
  Top 0.813: D5.C 69.01,48.95 71.75,46.2 85.41,46.2 87.05,47.85 87.31,48.11
  Top 0.889: REG1.2 69.74,53.71 69.06,53.03 69.06,51.33 D5.C | L3.1 87.77,48.56 87.05,47.85
N$8  (via drill 0.2 pad 0.03, 0.35)
  Top 0.102: U4.8 113.65,53.7 v113.44,53.49
  Top 0.381: R44.1 110,53.52 v110.03,53.49
  Route3 0.381: v113.44,53.49 v110.03,53.49
N$9
  Top 0.508: R11.1 136.21,31.71 R61.1
N$10  (via drill 0.2 pad 0.03, 0.35)
  Top 0.178: U4.16 114.55,52.37 v114.55,51.77
  Top 0.381: v104.83,56.13 R15.1
  Route3 0.381: v114.55,51.77 109.09,51.77 104.83,56.03 v104.83,56.13
N$11  (via drill 0.2 pad 0.03, 0.35)
  Top 0.102: U4.4 115.49,54.69
  Top 0.178: v114.93,56.3 114.93,55.87 115.49,55.32 115.49,54.69
  Top 0.635: R17.2 111.58,57.02 v111.84,56.77
  Route3 0.381: v111.84,56.77 114.47,56.77 v114.93,56.3
N$12
  Top 0.203: U4.6 117.91,53.7 118.11,53.51 118.11,52.39 118.43,52.08 R7.1
N$13
  Top 0.178: 119.39,54.46 R8.1
  Top 0.203: U4.1 117.92,54.11 118.27,54.46 119.39,54.46
N$14
  Top 0.203: U4.9 117.52,53.3 117.63,53.19 117.63,49.38 118.11,48.9 R5.1
N$15
  Top 0.152: R6.1
  Top 0.203: U4.12 117,52.59 117,47 117.63,46.36 R6.1
N$16  (via drill 1)
  Top 0.813: v89.69,19.22 89.69,21.67 R47.2
  Route3 0.813: X1.1 75.25,10.96 83.03,18.74 89.38,18.74 89.69,19.06 v89.69,19.22
N$17
  Top 0.508: R49.2 R47.1 85.09,21.76 84.45,22.39 C48.1
N$18
  Top 0.508: IC5.3 89.53,25.01 R49.1 91.44,24.93 | 91.44,24.93 91.59,24.93 R51.2 | 91.44,24.93 91.63,24.74 C50.1 C53.2
N$20
  Top 0.889: CT1.2 131.03,69.93 127.66,69.93 125.53,72.06 125.53,74.45 L1.P$2
N$21  (via drill 1)
  Top 0.889: R5.2 R6.2 v124.3,46.36
  Route3 0.889: v124.3,46.36 125.73,44.93 v125.73,38.26
  Bottom 0.889: 125.65,38.34 v125.73,38.26 124.24,38.26 Q5.2
N$22  (via drill 0.35, 1)
  Top 0.381: 16.29,5.4 14.48,7.22 R22.2 14.48,8.66 13.64,9.5 9.47,9.5 8.72,8.75 R23.2 8.41,7.74 v8.41,6.4
  Top 0.508: DZ2.C 16.29,5.4 | R19.2 v6.83,18.58 | C24.1 21.91,21.44 v24.77,18.58
  Top 0.813: C22.2 C20.2 22.38,43.82 | C24.1 38.42,21.44 42.55,17.31 U1.P$13-VIN+
  Top 0.889: 42.55,5.09 U1.P$13-VIN+ v42.55,2.71 | v27.62,53.51 v26.04,53.51 | v26.83,52.08 26.35,51.6 C22.2 | C20.2 C25.1 22.38,25.56 21.43,24.61 C24.1
  Bottom 0.381: v8.41,6.4 8.41,17.16 6.99,18.58
  Bottom 0.508: v24.77,18.58 6.99,18.58 v6.83,18.58
  Bottom 0.889: C26.1 43.81,9.37 42.55,8.1 v42.55,2.71 | LF1.4 28.1,53.98 v27.62,53.51 | v26.04,53.51 26.83,52.71 v26.83,52.08
N$23
  Top 0.381: Q1.1 12.3,12.88 11.77,12.36 R25.1
N$24
  Top 0.813: 52.12,55.61 53.58,57.07 53.1,57.56 47.07,57.56 C18.1
  Top 0.889: REG2.1 52.12,55.61 R21.1
  pour Top (hatched): 43.5,62.08 43.5,58.43 43.66,58.27 44.77,57.16 46.99,57.16 48.74,57.16 49.21,56.68 49.21,56.05 49.21,54.93 49.69,54.46 53.98,54.46 54.45,54.93 54.45,58.74 53.98,59.22 53.82,59.38 50.8,59.38 47.78,62.4 43.66,62.4 43.5,62.24
N$28
  Top 0.381: Q1.2 14.2,12.68 14.48,12.4 R22.1
N$29
  Top 0.381: Q2.3 8.89,11.07 R23.1 6.93,10.9 6.63,10.61
  Top 0.508: 6.63,10.61 6.63,3.37 7.46,2.55 36.99,2.55 37.47,3.02 U1.P$11-PO
N$30
  Top 0.381: 11.73,8.05 11.73,6.65 10.28,5.2 DZ1.C
  Top 0.813: R25.2 11.73,8.05
N$31
  Top 0.381: R26.2 20.07,8.16 R27.2 20.12,6.63 19.82,6.34 DZ2.A
N$34
  Top 0.381: Q3.1 17.46,12.41 17.27,12.22 R26.1
N$37  (via drill 1)
  Top 0.889: REG2.4 59.17,55.45 v59.21,55.41
  Bottom 0.813: R31.2 R32.1 66.83,43.51
  Bottom 0.889: v59.21,55.41 66.83,47.8 66.83,43.51
N$38
  Top 0.813: 55.77,54.25 56.94,53.08 D6.C 56.94,47.68 60.33,44.3 L4.1
  Top 0.889: REG2.2 55.77,54.25
  pour Top (hatched): 55.4,57.16 55.24,57 55.24,54.46 54.13,53.35 54.13,48.11 56.67,45.57 56.67,44.46 56.67,31.12 57.15,30.65 61.75,30.65 62.39,31.28 62.39,46.2 61.75,46.84 58.58,50.01 58.58,51.76 58.58,53.03 58.26,53.35 56.2,55.41 56.2,57.16
N$39
  Top 0.508: C32.2 R36.2 108.27,12.72 IC4.4
N$40
  Top 0.508: C33.1 106.08,26.64 R37.1 107.95,22.87 IC10.3
N$41
  Top 0.508: IC10.2 109.22,19.85 108.43,19.06 105.54,19.06 C34.2 102.42,19.82 R35.1
N$42  (via drill 0.5 pad 0.03)
  Top 0.381: 104.78,17.15 104.78,17.73 103.96,18.54 100.25,18.54 99.62,17.91 R38.2 | R33.1 104.93,5.56 v103.83,6.65 | v104.78,15.93 C34.1
  Top 0.508: 99.77,17.32 R38.2 | IC10.6 107.95,17.15 107.47,17.63 105.25,17.63 104.78,17.15 C34.1
  Route3 0.381: v103.83,6.65 103.83,11.73 105.92,13.82 105.92,14.99 104.98,15.93 v104.78,15.93
N$43  (via drill 0.5 pad 0.03)
  Top 0.381: IC9.4 100.37,47.79 v100.36,47.78 | v99.85,22.35 99.85,20.24 R38.1
  Route3 0.381: v100.36,47.78 99.85,47.27 v99.85,22.35
N$44
  Top 0.508: IC5.6 89.53,31.92 89.85,31.6 92.08,31.6 92.71,32.23 C51.1 94.49,32.36 95.09,31.76 | 95.09,31.76 95.44,32.11 C52.1 95.44,35.76 96.68,37 R42.2 | 95.09,31.76 94.93,31.6 94.93,31.45 R52.2
N$45
  Top 0.508: IC3.2 106.05,34.45 105.73,34.77 105.73,36.68 105.41,37 R42.1 105.73,37 106.68,37.95 C41.2 106.87,39.41 107,39.54 107,40.04 C37.2 106.87,42.11 109.06,44.29 R41.2
N$46
  Top 0.508: IC4.3 108.27,8.26 R34.1 R33.2
N$47
  Top 0.381: IC4.1 106.36,11.03 105.87,11.53 102.72,11.53 102.01,12.24 102.01,16.93 R35.2
  Top 0.508: R34.2 105.89,8.59 106.36,9.06 IC4.1
N$48
  Top 0.381: Q1.3 11.84,16.03 10.31,17.55 8.41,17.55 7.7,16.84 7.7,15.11 7.94,14.87 Q2.1
  Top 0.508: Q1.3 Q3.3
N$49
  Top 0.508: R20.3 90.62,8.23 90.81,8.42 90.36,8.42 C29.2 | R20.2 85.41,6.83 86.81,8.23 R20.3 | R24.1 87.95,8.25 R20.3
N$50
  Top 0.508: IC3.3 105.41,33.19 104.29,34.3 R43.1
  Top 0.813: R43.1 104.29,33.46 C38.1
N$51
  Top 0.381: IC9.3 105.89,47.79 R39.2
N$52
  Top 0.508: IC3.6 114.62,33.19 115.57,34.14 115.57,37 114.62,37.95 R29.1 114.45,39.38 113.67,40.17 C37.1 111.6,42.11 111.6,46.68 110.17,48.11 R39.1
N$53  (via drill 1)
  Top 0.813: 76.04,29.22 76.04,22.23 77.79,20.49 | 77.79,20.49 C27.1 | v73.82,27.15 73.98,27.15 76.04,29.22 | 76.04,29.22 L4.2 | 70.8,16.04 75.25,20.49 77.79,20.49
  Top 0.889: 70.8,16.04 66.93,16.04 IC1.1
  Bottom 0.813: R31.1 72.22,28.27 73.5,26.99 73.66,26.99 v73.82,27.15
  pour Top (hatched): 77.63,44.3 77.47,44.14 71.91,44.14 71.91,27.79 73.18,26.52 73.66,26.04 73.66,23.34 73.66,19.69 72.55,18.58 71.75,17.79 67.31,17.79 66.04,16.52 66.04,16.2 66.04,15.41 66.2,15.25 75.25,15.25 79.53,19.53 79.53,26.84 79.22,27.15 78.26,27.15 77.95,27.47 77.95,44.3
N$54
  Top 0.635: R20.1 C29.1 94,5.44 IC2.1 94.92,5.41 R28.2
N$55
  Top 0.508: C41.1 R29.2
N$56
  Top 0.508: C56.2 133.22,37.27 R68.2
  Top 0.889: U2.+ 133.32,39 C56.2
N$58
  Top 0.889: C46.2 65.56,85.1 56.36,85.1 56.52,85.25 R67.2
N$59  (via drill 0.2 pad 0.03, 0.35)
  Top 0.102: U4.5 114.7,54.11 v114,54.81
  Top 0.152: R14.2 103.47,58.99
  Top 0.381: v104.83,58.7 103.75,58.7 103.47,58.99
  Route3 0.381: v104.83,58.7 104.83,57.68 107.7,54.81 v114,54.81
N$61  (via drill 1)
  Top 0.889: R7.2 R8.2 v124.3,54.62
  Route3 0.889: v124.3,54.62 125.57,55.89 v125.57,61.6
  Bottom 0.889: v125.57,61.6 125.57,62.71 125.03,63.25 Q4.2
N$62
  Top 0.508: R50.1 84.14,29.69 84.77,30.33 87.95,30.33 88.27,30.01 IC5.2 88.27,29.69 88.9,30.33 91.95,30.33 C51.2 92.71,28.1 93.98,26.83 97.47,26.83 97.94,27.3 R53.1 R52.1
N$64
  Top 0.508: R50.2 83.35,32.55 R48.1 81.92,34.45 81.6,34.77 C49.2
N$65
  Top 0.508: R54.2 96.67,21.48 C53.1
N$67
  Top 0.508: R53.2 96.52,29.84 96.52,33.19 97.47,34.14 C52.2
N$68  (via drill 0.38)
  Top 0.508: C55.1 135.75,13.69 R57.1 136.05,13.39 | 136.05,13.39 136.05,12.34 R56.2 | IC8.4 134.75,23.85 134.78,23.82 v134.7,23.74 | v137.16,13.18 136.26,13.18 136.05,13.39
  Top 0.635: R57.1 135.92,11.24 R56.2
  Bottom 0.508: v134.7,23.74 135.81,23.74 138.58,20.97
  Bottom 0.635: 138.58,20.97 138.58,14.6 v137.16,13.18
N$69
  Top 0.508: IC8.3 137.35,25.85 136.03,27.18 R61.2
N$70
  Top 0.508: IC8.1 136.52,22.71 136.05,23.18 136.05,25.09 135.53,25.61 133.17,25.61 132.9,25.88 R62.1
N$71
  Top 0.635: C55.2 136.7,16.48 137.32,17.1 R57.2 137.32,16.76 138.72,15.36 R57.3 138.72,11.24 R55.1
N$72
  Top 0.305: R62.2 131.6,22.56 131.44,22.4 | U3.1 131.86,18.73 131.44,19.15 131.44,19.69 130.81,20.33 130.81,20.8 130.49,21.12 129.54,21.12 129.22,21.44 129.22,22.87 129.38,23.03
  Top 0.508: R63.1 129.38,23.03 R62.2
N$74
  Top 0.508: LED1.C R65.2
N$75
  Top 0.305: U3.6 130.43,19.78 130.81,19.41 130.81,18.47 131.17,18.1 131.92,18.1 132.24,17.79 132.24,14.94 131.28,13.98
  Top 0.508: R64.2 131.28,13.98 131.92,13.34 C58.1
N$76  (via drill 0.65, 1)
  Top 0.254: U3.3 132.46,19.78 132.45,19.79
  Top 0.305: U3.3 132.19,19.78 132.17,19.8 132.19,19.8 131.76,20.23 131.76,21.28
  Top 0.635: R65.1 127.16,4.93 125.73,6.36 125.73,20.17 126.68,21.12 v127,21.12 | v131.6,21.28 131.76,21.28
  Bottom 0.635: v127,21.12 127.16,21.28 v131.6,21.28
PE  (via drill 1)
  Top 0.889: C22.1 C23.2 C21.2 C20.1 C22.1 | v16.35,59.86 17.62,59.86 | 17.62,59.86 v17.94,59.86 | C22.1 17.3,59.54 17.62,59.86 | C3.1 44.61,90.49 44.93,90.18 45.24,90.18 C43.1 45.4,90.34 45.4,86.68 | 45.4,86.68 C44.2 | 45.4,86.68 38.42,86.68 C42.2 C3.1 | C3.1 34.92,87.16 26.04,87.16 24.13,85.25 24.13,71.76 17.78,65.41 17.78,60.01 17.62,59.86
  Bottom 0.889: X5.2 4.92,88.59 3.02,86.68 3.02,66.2 4.76,64.46 14.13,64.46 16.35,62.24 v16.35,59.86
PIKP
  Top 0.305: D3.1 111.7,60.94 R17.1
  Top 0.381: R18.2 110.79,63.04 111.58,62.26 R17.1
PWM_IN  (via drill 0.5 pad 0.03)
  Top 0.381: R44.2 R16.2 104.11,52.74 v104.11,51.94 | v106.2,44.02 106.2,45.55 R41.1
  Top 0.508: IC9.1 105.09,45.89 105.41,45.57 R41.1
  Route3 0.381: v104.11,51.94 104.11,46.1 v106.2,44.02
REF25  (via drill 0.5 pad 0.03, 1)
  Top 0.508: R66.1 R24.2 93.99,13.02 C28.1 94.44,11.27 IC2.2
  Top 0.889: C28.1 95.25,12.07 v100.01,12.07 | R36.1 114.62,12.06 v114.78,11.91 115.25,11.91 | R43.2 101.45,29.37 102.71,28.1 107.63,28.1 108.9,26.83 R37.2 108.98,26.59 v111.71,26.59
  Bottom 0.889: v100.01,12.07 106.55,12.07 109.07,12.07 | 109.07,12.07 114.62,12.07 v114.78,11.91 | v111.71,26.59 110.67,25.55 110.67,13.67 109.07,12.07
VFBK  (via drill 1, 1 pad 0.03)
  Top 0.635: R46.2 141.41,59.53 R4.1 141.4,56.7 v141.5,56.59
  Top 0.889: v79.22,32.55 R48.2
  Route3 0.635: v79.22,32.55 93.2,32.55 95.35,30.4 95.35,21.62 98.5,18.47 123.6,18.47 126.26,15.8 126.26,15.65 139.14,15.65 141.4,17.91 141.4,56.49 v141.5,56.59
  Route3 0.889: 83.03,24.45 82.95,24.38 81.67,24.38 80.01,26.04 80.01,32.39 79.85,32.55 v79.22,32.55
(copper drawn outside any net)
  shapes: Route2 area x2, Top area x2